# EAGLE schematic BEP33_6panel_90Grad (EAGLE 6.5.0), part 2 of 2
## Sheet 5 of 7
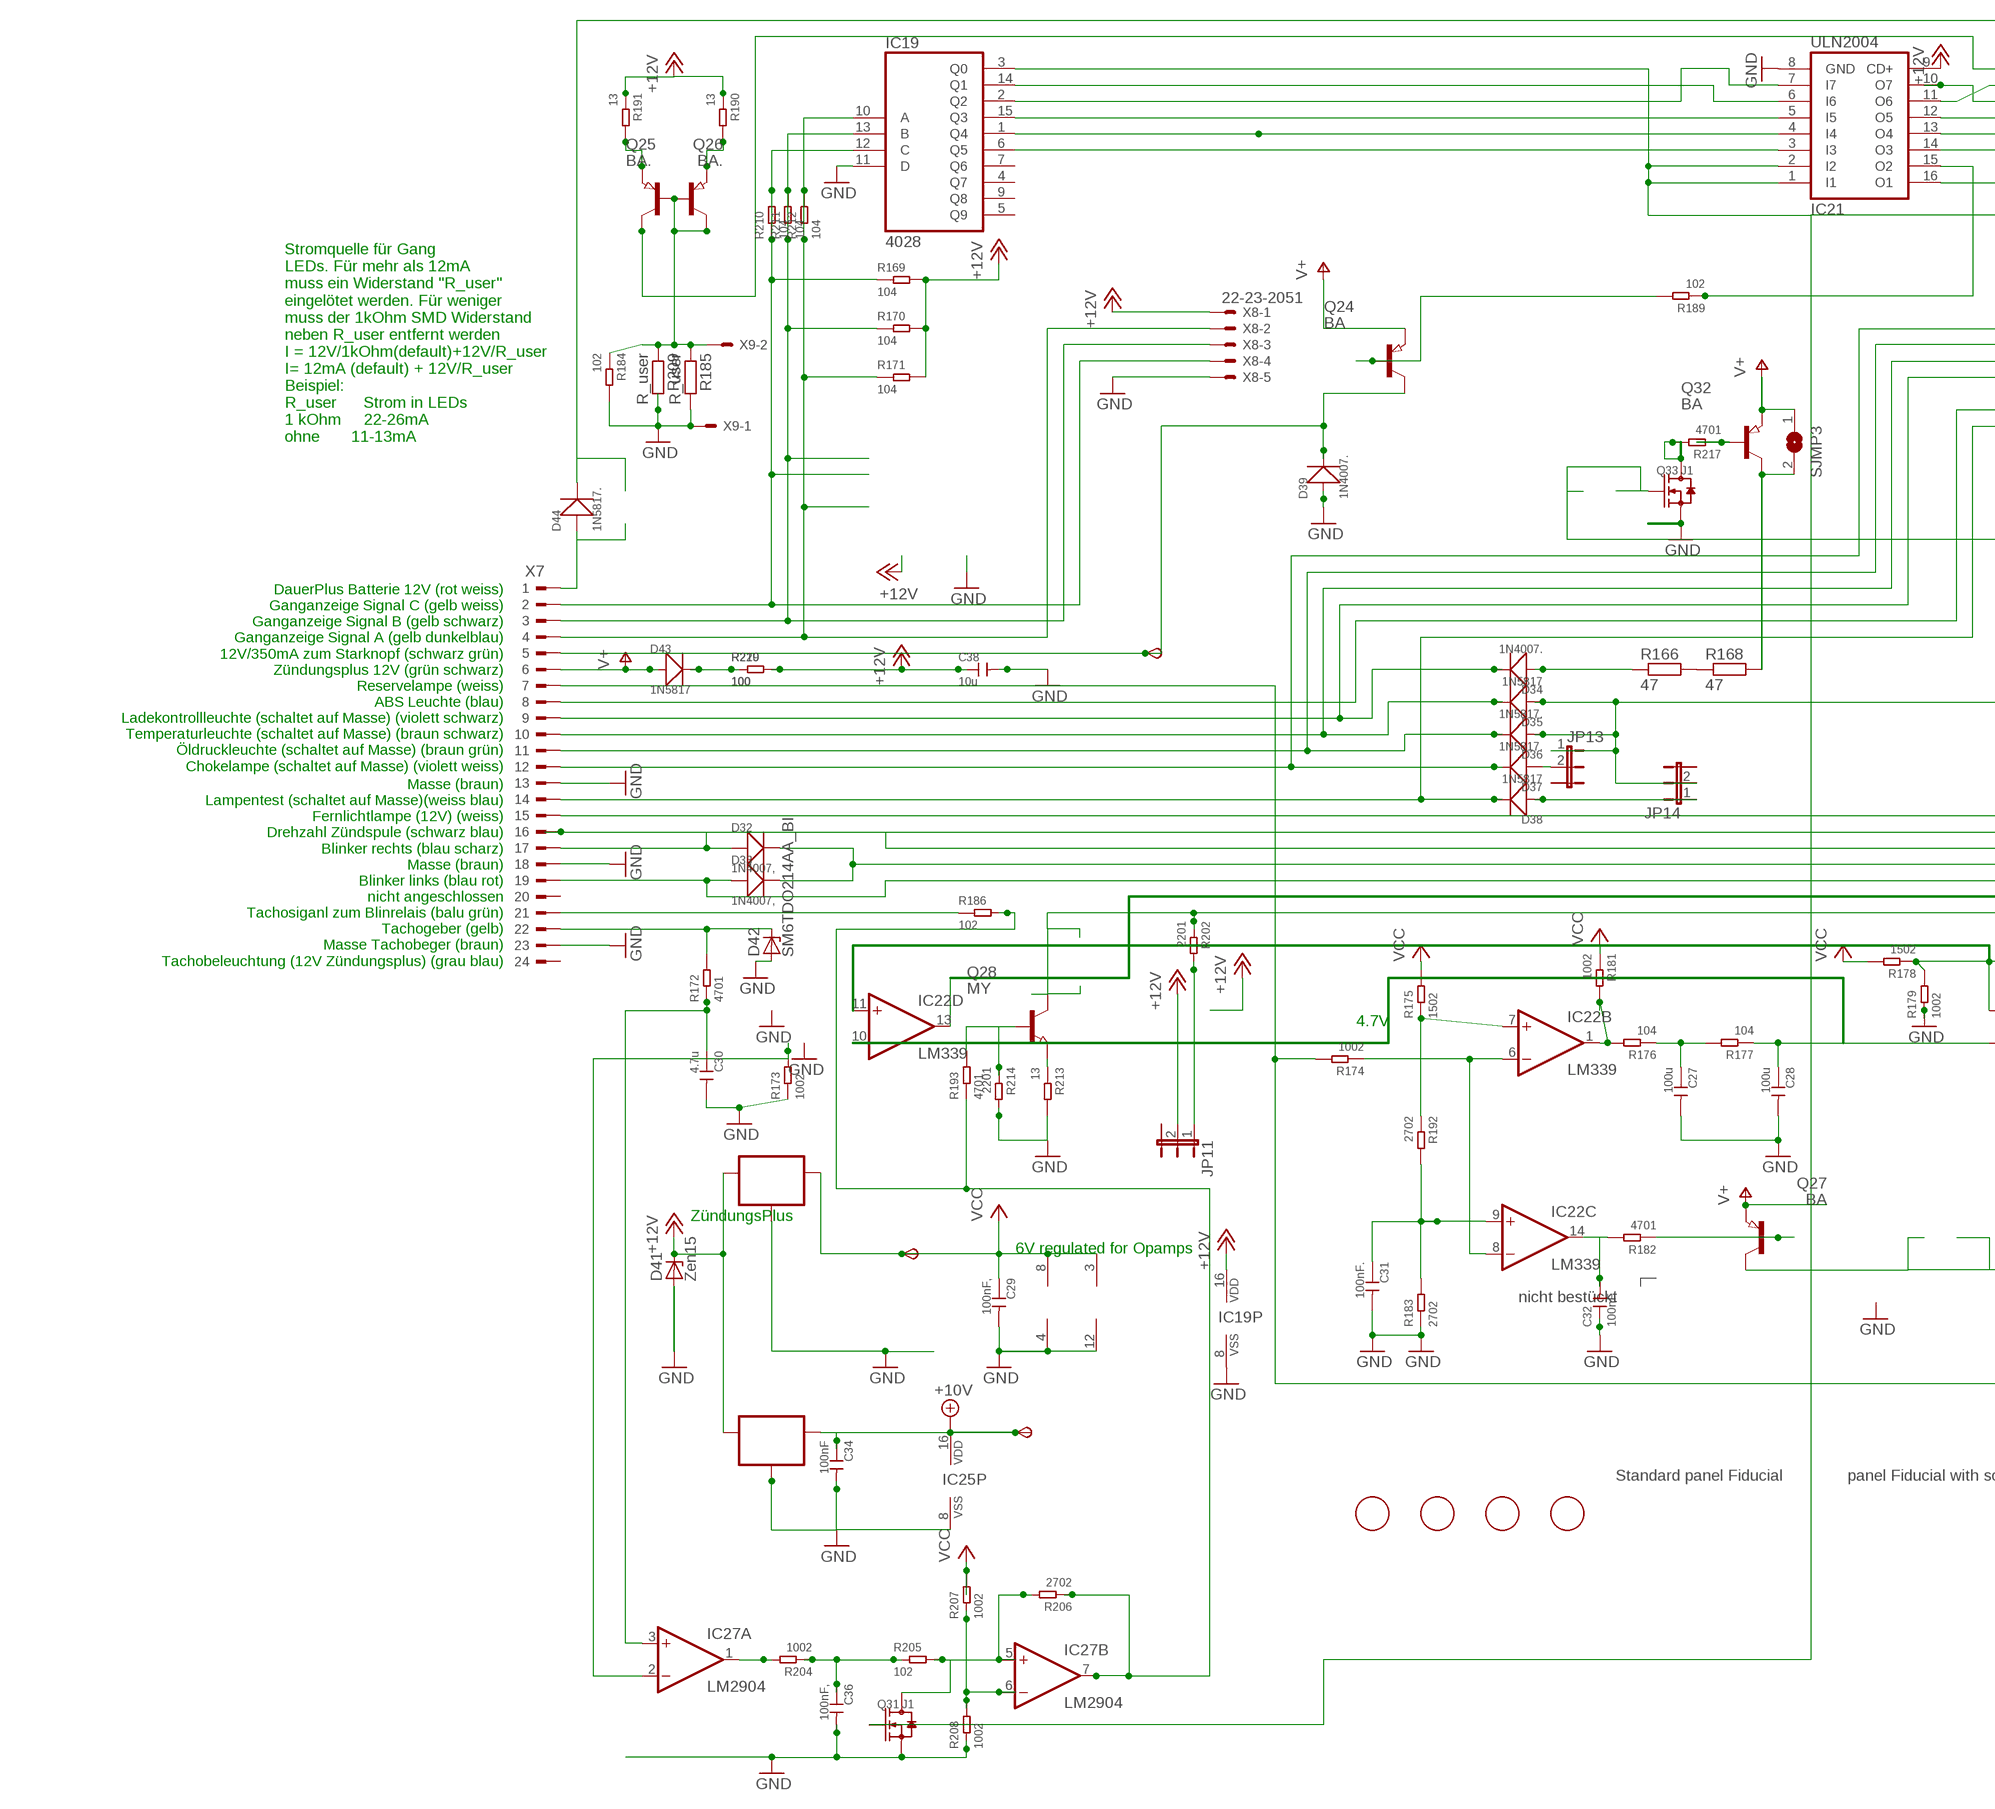
[diagram p7: schematic, sheet 5, part 1 of 2]
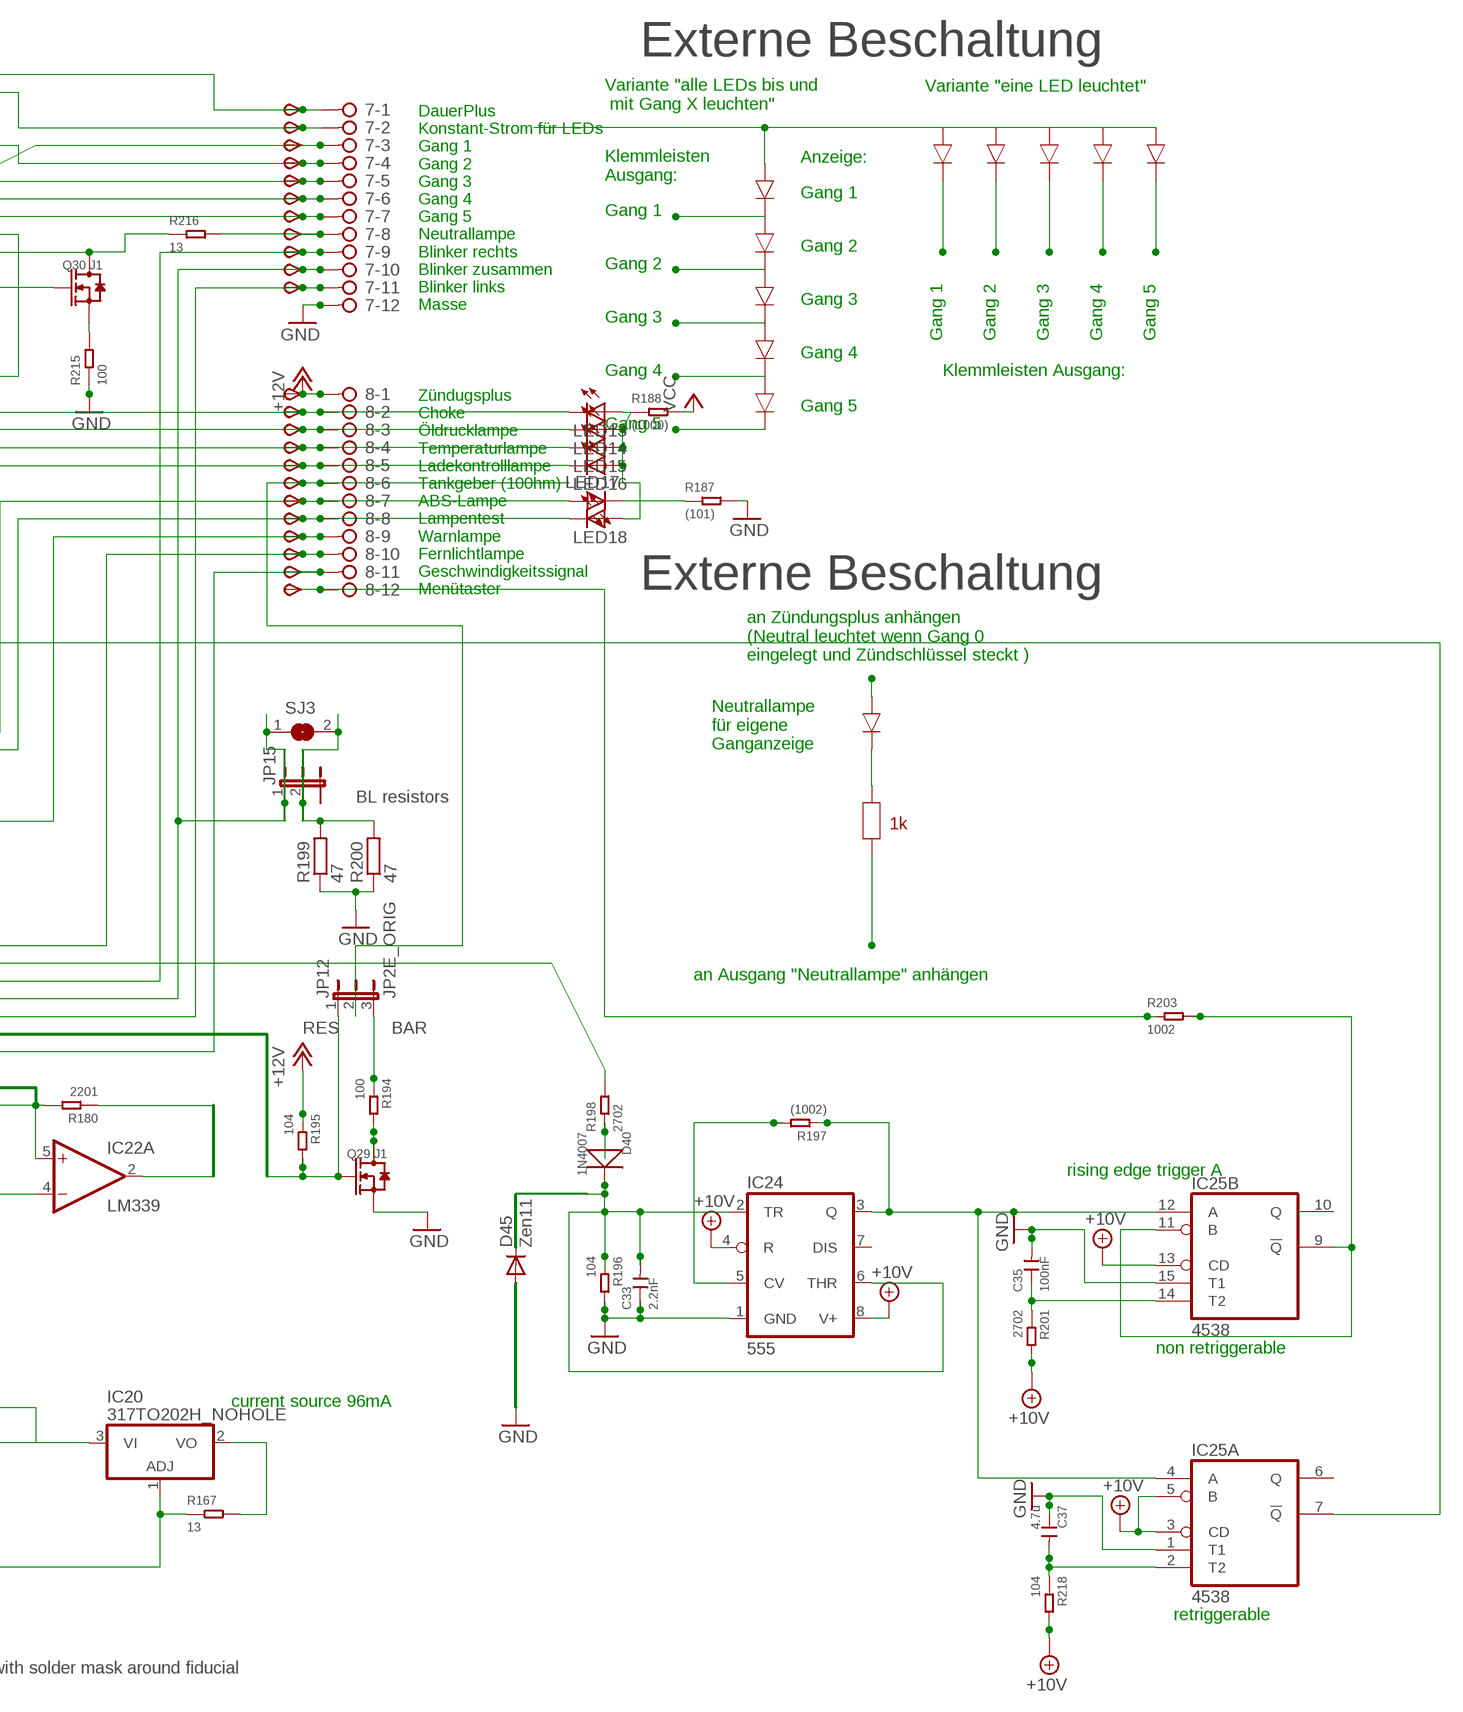
[diagram p8: schematic, sheet 5, part 2 of 2]

### Parts
6V3  TPSB2.0  [B2.0]
7  2081-1132  [12-PIN]
8  2081-1132  [12-PIN]
10V3  TPSB2.0  [B2.0]
C27  100u  CERAMIC-100UF-6.3V-20%-X5R(1206)  [C1206]
C28  100u  CERAMIC-100UF-6.3V-20%-X5R(1206)  [C1206]
C29  100nF,  CERAMIC-100NF-50V-10%-X7R(0805)  [C0805]
C30  4.7u  CERAMIC-4.7UF-25V-10%-X5R(0805)  [C0805]
C31  100nF.  CERAMIC-100NF-50V-10%-X7R(0805)  [C0805]
C32  100nF.  CERAMIC-100NF-50V-10%-X7R(0805)  [C0805]
C33  2.2nF  CERAMIC-100NF-50V-10%-X7R(0805)  [C0805]
C34  100nF  CERAMIC-100NF-50V-10%-X7R(0805)  [C0805]
C35  100nF  CERAMIC-100NF-50V-10%-X7R(0805)  [C0805]
C36  100nF,  CERAMIC-100NF-50V-10%-X7R(0805)  [C0805]
C37  4.7u  CERAMIC-4.7UF-25V-10%-X5R(0805)  [C0805]
C38  10u  CERAMIC-100UF-6.3V-20%-X5R(1206)  [C1206]
D32  1N4007,  DIODE-GEN-PURPOSE-1KV-1A(DO-214AC)  [DO-214AC]
D33  1N4007,  DIODE-GEN-PURPOSE-1KV-1A(DO-214AC)  [DO-214AC]
D34  1N4007.  DIODE-GEN-PURPOSE-1KV-1A(DO-214AC)  [DO-214AC]
D35  1N5817  DIODE-GEN-PURPOSE-1KV-1A(DO-214AC)DO-214AC/1206  [DO-214AC_SLIM]
D36  1N5817.  DIODE-GEN-PURPOSE-1KV-1A(DO-214AC)DO-214AC/1206  [DO-214AC_SLIM]
D37  1N5817.  DIODE-GEN-PURPOSE-1KV-1A(DO-214AC)DO-214AC/1206  [DO-214AC_SLIM]
D38  1N5817  DIODE-GEN-PURPOSE-1KV-1A(DO-214AC)DO-214AC/1206  [DO-214AC_SLIM]
D39  1N4007.  DIODE-GEN-PURPOSE-1KV-1A(DO-214AC)  [DO-214AC]
D40  1N4007  DIODE-GEN-PURPOSE-1KV-1A(DO-214AC)  [DO-214AC]
D41  Zen15  SM6T  [DO214AA]
D42  SM6TDO214AA_BI  [DO214AA_BI]
D43  1N5817  DIODE-GEN-PURPOSE-1KV-1A(DO-214AC)DO-214AC/1206  [DO-214AC_SLIM]
D44  1N5817.  DIODE-GEN-PURPOSE-1KV-1A(DO-214AC)DO-214AC/1206  [DO-214AC_SLIM]
D45  Zen11  CGRM4001-G  [SOD-123_MINI-SMA]
FID11  FIDUCIAL  [FIDUCIAL_1MM]
FID12  FIDUCIAL  [FIDUCIAL_1MM]
FID13  FIDUCIAL  [FIDUCIAL_1MM]
FID14  FIDUCIAL  [FIDUCIAL_1MM]
IC19  4028  4028D  [SO16]
IC20  317TO202H_NOHOLE  [TO220H_NOHOLE]
IC21  ULN2004  ULN2004AD  [SO16]
IC22  LM339  LM339D  [SO14]
IC23  78L06  78LXXSOT89_ROUND  [SOT89_ROUND]
IC24  555  NE555D  [SO08]
IC25  4538  4538D  [SO16]
IC26  78L10  78LXXSOT89_ROUND  [SOT89_ROUND]
IC27  LM2904  LM358D  [SO08]
JP11  JP2EJP2_SMALLPADS  [JP2_SMALLPADS]
JP12  JP2E_ORIG  [JP2_ORIG_SMALLPADS]
JP13  JP2EJP2_SMALLPADS  [JP2_SMALLPADS]
JP14  JP2EJP2_SMALLPADS  [JP2_SMALLPADS]
JP15  JP2EJP2_SMALLPADS  [JP2_SMALLPADS]
LED13  LEDLD260  [LD260]
LED14  LEDLD260  [LD260]
LED15  LEDLD260  [LD260]
LED16  LEDLD260  [LD260]
LED17  LEDLD260  [LD260]
LED18  LEDLD260  [LD260]
Q24  BA  PNP-TRANSISTOR_SOT89  [SOT89]
Q25  BA.  PNP-TRANSISTOR_SOT89  [SOT89]
Q26  BA.  PNP-TRANSISTOR_SOT89  [SOT89]
Q27  BA  PNP-TRANSISTOR_SOT89  [SOT89]
Q28  MY  NPN-TRANSISTOR_SOT89  [SOT89]
Q29  J1  SMD-MOSFET-N-CH-50V-200MA-BSS138W-7-F(SOT-23)  [SOT-23]
Q30  J1  SMD-MOSFET-N-CH-50V-200MA-BSS138W-7-F(SOT-23)  [SOT-23]
Q31  J1  SMD-MOSFET-N-CH-50V-200MA-BSS138W-7-F(SOT-23)  [SOT-23]
Q32  BA  PNP-TRANSISTOR_SOT89  [SOT89]
Q33  J1  SMD-MOSFET-N-CH-50V-200MA-BSS138W-7-F(SOT-23)  [SOT-23]
R166  47  R-EU_V235/17_1MM  [V235/17_1MM]
R167  13  SMD-RES-13R-5%-1/4W(1206)  [R1206]
R168  47  R-EU_V235/17_1MM  [V235/17_1MM]
R169  104  SMD-RES-10K-1%-1/8W(0805)  [R0805]
R170  104  SMD-RES-10K-1%-1/8W(0805)  [R0805]
R171  104  SMD-RES-10K-1%-1/8W(0805)  [R0805]
R172  4701  SMD-RES-4.7K-5%-1/8W(0805)  [R0805]
R173  1002  SMD-RES-10K-1%-1/8W(0805)  [R0805]
R174  1002  SMD-RES-10K-1%-1/8W(0805)  [R0805]
R175  1502  SMD-RES-10K-1%-1/8W(0805)  [R0805]
R176  104  SMD-RES-10K-1%-1/8W(0805)  [R0805]
R177  104  SMD-RES-10K-1%-1/8W(0805)  [R0805]
R178  1502  SMD-RES-10K-1%-1/8W(0805)  [R0805]
R179  1002  SMD-RES-10K-1%-1/8W(0805)  [R0805]
R180  2201  SMD-RES-2.2K-5%-1/8W(0805)  [R0805]
R181  1002  SMD-RES-10K-1%-1/8W(0805)  [R0805]
R182  4701  SMD-RES-4.7K-5%-1/8W(0805)  [R0805]
R183  2702  SMD-RES-4.7K-5%-1/8W(0805)  [R0805]
R184  102  SMD-RES-1K-5%-1/8W(0805)  [R0805]
R185  R_user  R-EU_R0805  [R0805]
R186  102  SMD-RES-220R-5%-1/8W(0805)  [R0805]
R187  (101)  SMD-RES-100R-5%-1/8W(0805)  [R0805]
R188  (1000)  SMD-RES-100R-5%-1/8W(0805)  [R0805]
R189  102  SMD-RES-1K-5%-1/8W(0805)  [R0805]
R190  13  SMD-RES-13R-5%-1/4W(1206)  [R1206]
R191  13  SMD-RES-13R-5%-1/4W(1206)  [R1206]
R192  2702  SMD-RES-4.7K-5%-1/8W(0805)  [R0805]
R193  4701  SMD-RES-4.7K-5%-1/8W(0805)  [R0805]
R194  100  SMD-RES-2.2K-5%-1/8W(0805)  [R0805]
R195  104  SMD-RES-10K-1%-1/8W(0805)  [R0805]
R196  104  SMD-RES-10K-1%-1/8W(0805)  [R0805]
R197  (1002)  SMD-RES-10K-1%-1/8W(0805)  [R0805]
R198  2702  SMD-RES-10K-1%-1/8W(0805)  [R0805]
R199  47  R-EU_V235/17_1MM  [V235/17_1MM]
R200  47  R-EU_V235/17_1MM  [V235/17_1MM]
R201  2702  SMD-RES-4.7K-5%-1/8W(0805)  [R0805]
R202  2201  SMD-RES-2.2K-5%-1/8W(0805)  [R0805]
R203  1002  SMD-RES-4.7K-5%-1/8W(0805)  [R0805]
R204  1002  SMD-RES-10K-1%-1/8W(0805)  [R0805]
R205  102  SMD-RES-1K-5%-1/8W(0805)  [R0805]
R206  2702  SMD-RES-4.7K-5%-1/8W(0805)  [R0805]
R207  1002  SMD-RES-1K-5%-1/8W(0805)  [R0805]
R208  1002  SMD-RES-1K-5%-1/8W(0805)  [R0805]
R209  R_user  R-EU_R0805  [R0805]
R210  104  SMD-RES-10K-1%-1/8W(0805)  [R0805]
R211  104  SMD-RES-10K-1%-1/8W(0805)  [R0805]
R212  104  SMD-RES-10K-1%-1/8W(0805)  [R0805]
R213  13  SMD-RES-13R-5%-1/4W(1206)  [R1206]
R214  2201  SMD-RES-1K-5%-1/8W(0805)  [R0805]
R215  100  SMD-RES-220R-5%-1/8W(0805)  [R0805]
R216  13  SMD-RES-13R-5%-1/4W(1206)  [R1206]
R217  4701  SMD-RES-4.7K-5%-1/8W(0805)  [R0805]
R218  104  SMD-RES-4.7K-5%-1/8W(0805)  [R0805]
R219  100  SMD-RES-2.2K-5%-1/8W(0805)  [R0805]
R220  100  SMD-RES-2.2K-5%-1/8W(0805)  [R0805]
SJ3  SJ  [SJ]
SJMP3  SJ  [SJ]
START3  TPSB2.0  [B2.0]
TP70  TPSB2.0  [B2.0]
TP71  TPSB2.0  [B2.0]
TP72  TPSB2.0  [B2.0]
TP73  TPSB2.0  [B2.0]
TP74  TPSB2.0  [B2.0]
TP75  TPSB2.0  [B2.0]
TP76  TPSB2.0  [B2.0]
TP77  TPSB2.0  [B2.0]
TP78  TPSB2.0  [B2.0]
TP79  TPSB2.0  [B2.0]
TP80  TPSB2.0  [B2.0]
TP81  TPSB2.0  [B2.0]
TP82  TPSB2.0  [B2.0]
TP83  TPSB2.0  [B2.0]
TP84  TPSB2.0  [B2.0]
TP85  TPSB2.0  [B2.0]
TP86  TPSB2.0  [B2.0]
TP87  TPSB2.0  [B2.0]
TP88  TPSB1,27  [B1,27]
TP89  TPSB2.0  [B2.0]
TP90  TPSB2.0  [B2.0]
TP91  TPSB2.0  [B2.0]
TP92  TPSB2.0  [B2.0]
X7  CON_BMWV2  [24-PIN_V2]
X8  22-23-2051  [22-23-2051]
X9  22-23-2021  [22-23-2021]

### Nets
+10V: 10V3.TP(PP) C34.1 IC24.4(R) IC24.8(V+) IC25.3(A:CD) IC25.5(A:B) IC25.13(B:CD) IC25.16(P:VDD) IC26.1(OUT) R201.2 R218.2 ; also sheet 2,3,4,6,7
+12V: 8.1 C38.1 D41.C IC19.16(VDD) IC21.9(CD+) IC23.3(IN) IC26.3(IN) JP11.2 R169.2 R170.2 R171.2 R190.1 R191.1 R195.1 R219.2 R220.2 TP91.TP(PP) X8.1 ; also sheet 2,3,4,6,7
+12V4: 8.11 Q28.2(C) R202.1 TP90.TP(PP)
GND: 7.12 C27.2 C28.2 C29.2 C30.2 C31.2 C32.1 C33.1 C34.2 C35.2 C36.2 C37.1 C38.2 D39.1(+) D41.A D42.A D45.A IC19.8(VSS) IC19.11(D) IC21.8(GND) IC22.12(P:GND) IC23.2(GND) IC23.2@1(GND) IC24.1(GND) IC25.1(A:T1) IC25.8(P:VSS) IC25.15(B:T1) IC26.2(GND) IC26.2@1(GND) IC27.4(P:V-) Q29.2(S) Q31.2(S) Q33.2(S) R173.1 R179.1 R183.1 R184.2 R185.2 R187.2 R196.2 R199.1 R200.1 R208.1 R209.2 R213.2 R214.2 R215.1 X7.13 X7.18 X7.23 X8.5 X9.1 ; also sheet 2,3,4,6,7
N$701: R166.2 R168.1
N$702: 8.9 D35.1(+) D36.1(+) JP13.1 JP14.2 TP88.TP(PP)
N$703: IC19.10(A) R171.1 R212.1 R212.2 X7.4 X8.2
N$704: IC19.13(B) R170.1 R211.1 R211.2 X7.3 X8.3
N$705: D39.2(-) Q24.2(C) START3.TP(PP) X7.5
N$706: IC19.12(C) R169.1 R210.1 R210.2 X7.2 X8.4
N$707: 8.7 LED17.A TP86.TP(PP) X7.8
N$708: 8.2 D37.2(-) LED13.K(C) TP81.TP(PP) X7.12
N$709: 8.3 D36.2(-) LED14.K(C) TP82.TP(PP) X7.11
N$710: 8.4 D35.2(-) LED15.K(C) TP83.TP(PP) X7.10
N$711: 8.8 D38.2(-) LED18.K(C) TP87.TP(PP) X7.14
N$712: 7.9 D32.1(+) TP78.TP(PP) X7.17
N$713: 7.11 D33.1(+) TP80.TP(PP) X7.19
N$714: D42.C R172.2 X7.22
N$715: C30.1 IC27.3(A:+IN) R172.1
N$716: IC22.1(B:OUT) R176.2 R181.2
N$717: C27.1 R176.1 R177.2
N$718: C28.1 IC22.4(A:-IN) IC22.10(D:-IN) R177.1
N$719: IC22.5(A:+IN) IC22.11(D:+IN) R178.1 R179.2 R180.2
N$720: C31.1 IC22.9(C:+IN) R183.2 R192.2
N$721: C32.2 IC22.14(C:OUT) R182.2
N$722: Q27.1(B) R182.1
N$723: IC19.2(Q2) IC21.7(I7)
N$724: 7.5 IC21.12(O5) TP74.TP(PP)
N$725: IC19.1(Q4) IC21.4(I4)
N$726: 8.10 TP89.TP(PP) X7.15
N$727: 8.5 D34.2(-) LED16.K(C) TP84.TP(PP) X7.9
N$728: D34.1(+) R166.1
N$729: IC19.6(Q5) IC21.3(I3)
N$730: 7.4 IC21.10(O7) TP73.TP(PP)
N$731: IC20.1(ADJ) R167.1 R174.2 X7.7
N$732: IC22.6(B:-IN) IC22.8(C:-IN) R174.1
N$733: 7.2 Q26.2(C) TP71.TP(PP)
N$734: 7.1 D44.2(-) TP70.TP(PP)
N$748: R198.2 X7.16
N$749: IC19.15(Q3) IC21.5(I5)
N$750: 7.6 IC21.13(O4) TP75.TP(PP)
N$751: 7.7 IC21.14(O3) TP76.TP(PP)
N$752: 8.6 JP12.2 TP85.TP(PP)
N$753: LED17.K(C) R187.1
N$754: LED13.A LED14.A LED15.A LED16.A LED18.A R188.1
N$755: Q24.1(B) R189.2
N$756: IC19.3(Q0) IC21.1(I1) IC21.2(I2) Q30.1(G) Q31.1(G)
N$757: IC19.14(Q1) IC21.6(I6)
N$758: 7.3 IC21.11(O6) TP72.TP(PP)
N$759: Q25.1(B) Q25.2(C) Q26.1(B) R184.1 R185.1 R209.1 X9.2
N$760: Q26.3(E) R191.2
N$761: Q25.3(E) R190.2
N$762: IC22.7(B:+IN) R175.1 R192.1
N$763: IC27.2(A:-IN) R173.2
N$764: Q28.1(B) R193.2 R214.1
N$765: Q29.3(D) R194.2
N$766: IC20.2(VO) R167.2
N$767: IC20.3(VI) Q27.2(C)
N$768: IC24.5(CV) R197.2
N$769: IC24.3(Q) IC25.4(A:A) IC25.12(B:A) R197.1
N$770: D40.1(+) R198.1
N$771: 7.10 D32.2(-) D33.2(-) JP15.1 SJ3.1 TP79.TP(PP)
N$772: JP15.2 R199.2 R200.2 SJ3.2
N$773: IC25.9(B:!Q) IC25.11(B:B) R203.2
N$774: C35.1 IC25.14(B:T2) R201.1
N$775: JP11.1 R202.2
N$776: IC21.15(O2) R189.1
N$777: 8.12 R203.1 TP92.TP(PP)
N$778: D37.1(+) JP13.2
N$779: IC27.1(A:OUT) R204.2
N$780: C36.1 R204.1 R205.1
N$781: IC27.5(B:+IN) Q31.3(D) R205.2 R206.2
N$782: IC27.6(B:-IN) R207.1 R208.2
N$783: D38.1(+) JP14.1
N$784: JP12.3 R194.1
N$785: IC22.13(D:OUT) JP12.1 Q29.1(G) R195.2
N$786: R186.1 X7.21
N$787: IC21.16(O1) Q30.3(D) R216.1
N$788: D43.2(-) R219.1 R220.1
N$789: 7.8 R216.2 TP77.TP(PP)
N$790: Q30.2(S) R215.2
N$791: D44.1(+) X7.1
N$792: Q28.3(E) R213.1
N$793: C33.2 D40.2(-) D45.C IC24.2(TR) IC24.6(THR) R196.1
N$794: Q32.1(B) R217.1
N$795: Q33.3(D) R217.2
N$796: Q32.2(C) R168.2 SJMP3.2
N$797: IC27.7(B:OUT) R186.2 R193.1 R206.1
N$798: IC22.2(A:OUT) R180.1
N$799: IC25.7(A:!Q) Q33.1(G)
N$800: C37.2 IC25.2(A:T2) R218.1
V+: D43.1(+) Q24.3(E) Q27.3(E) Q32.3(E) SJMP3.1 X7.6 ; also sheet 2,3,4,6,7
VCC: 6V3.TP(PP) C29.1 IC22.3(P:V+) IC23.1(OUT) IC27.8(P:V+) R175.2 R178.2 R181.1 R188.2 R207.2 ; also sheet 2,3,4,6,7
Unconnected: IC19.4(Q7) IC19.5(Q9) IC19.7(Q6) IC19.9(Q8) IC24.7(DIS) IC25.6(A:Q) IC25.10(B:Q) X7.20 X7.24

### Notes on the sheet
- Externe Beschaltung
- Variante "eine LED leuchtet"
- Variante "alle LEDs bis und
   mit Gang X leuchten"
- Anzeige:
- Klemmleisten
  Ausgang:
- Gang 1
- DauerPlus
  Konstant-Strom für LEDs
  Gang 1
  Gang 2
  Gang 3
  Gang 4
  Gang 5
  Neutrallampe
  Blinker rechts
  Blinker zusammen
  Blinker links
  Masse
- Gang 1
- Gang 2
- Gang 2
- Gang 3
- Gang 3
- Gang 1 | Gang 2 | Gang 3 | Gang 4 | Gang 5
- Gang 4
- Gang 4 | Klemmleisten Ausgang:
- Gang 5
- Gang 5
- Zündugsplus
  Choke
  Öldrucklampe
  Temperaturlampe
  Ladekontrolllampe
  Tankgeber (100hm)
  ABS-Lampe
  Lampentest
  Warnlampe
  Fernlichtlampe
  Geschwindigkeitssignal
  Menütaster
- Stromquelle für Gang
  LEDs. Für mehr als 12mA
  muss ein Widerstand "R_user"
  eingelötet werden. Für weniger
  muss der 1kOhm SMD Widerstand
  neben R_user entfernt werden
  I = 12V/1kOhm(default)+12V/R_user
  I= 12mA (default) + 12V/R_user
  Beispiel:
  R_user      Strom in LEDs
  1 kOhm     22-26mA
  ohne       11-13mA
- Externe Beschaltung
- an Zündungsplus anhängen
  (Neutral leuchtet wenn Gang 0
  eingelegt und Zündschlüssel steckt )
- Neutrallampe
  für eigene
  Ganganzeige
- DauerPlus Batterie 12V (rot weiss)
  Ganganzeige Signal C (gelb weiss)
  Ganganzeige Signal B (gelb schwarz)
  Ganganzeige Signal A (gelb dunkelblau)
  12V/350mA zum Starknopf (schwarz grün)
  Zündungsplus 12V (grün schwarz)
  Reservelampe (weiss)
  ABS Leuchte (blau)
  Ladekontrollleuchte (schaltet auf Masse) (violett schwarz)
  Temperaturleuchte (schaltet auf Masse) (braun schwarz)
  Öldruckleuchte (schaltet auf Masse) (braun grün)
  Chokelampe (schaltet auf Masse) (violett weiss)
- BL resistors
- 1k
- an Ausgang "Neutrallampe" anhängen
- Masse (braun)
  Lampentest (schaltet auf Masse)(weiss blau)
  Fernlichtlampe (12V) (weiss)
  Drehzahl Zündspule (schwarz blau)
  Blinker rechts (blau scharz)
  Masse (braun)
  Blinker links (blau rot)
  nicht angeschlossen
  Tachosiganl zum Blinrelais (balu grün)
  Tachogeber (gelb)
  Masse Tachobeger (braun)
  Tachobeleuchtung (12V Zündungsplus) (grau blau)
- RES | BAR
- 4.7V | rising edge trigger A
- non retriggerable
- ZündungsPlus
- current source 96mA
- 6V regulated for Opamps
- nicht bestückt
- retriggerable
- Standard panel Fiducial | panel Fiducial with solder mask around fiducial

## Sheet 6 of 7
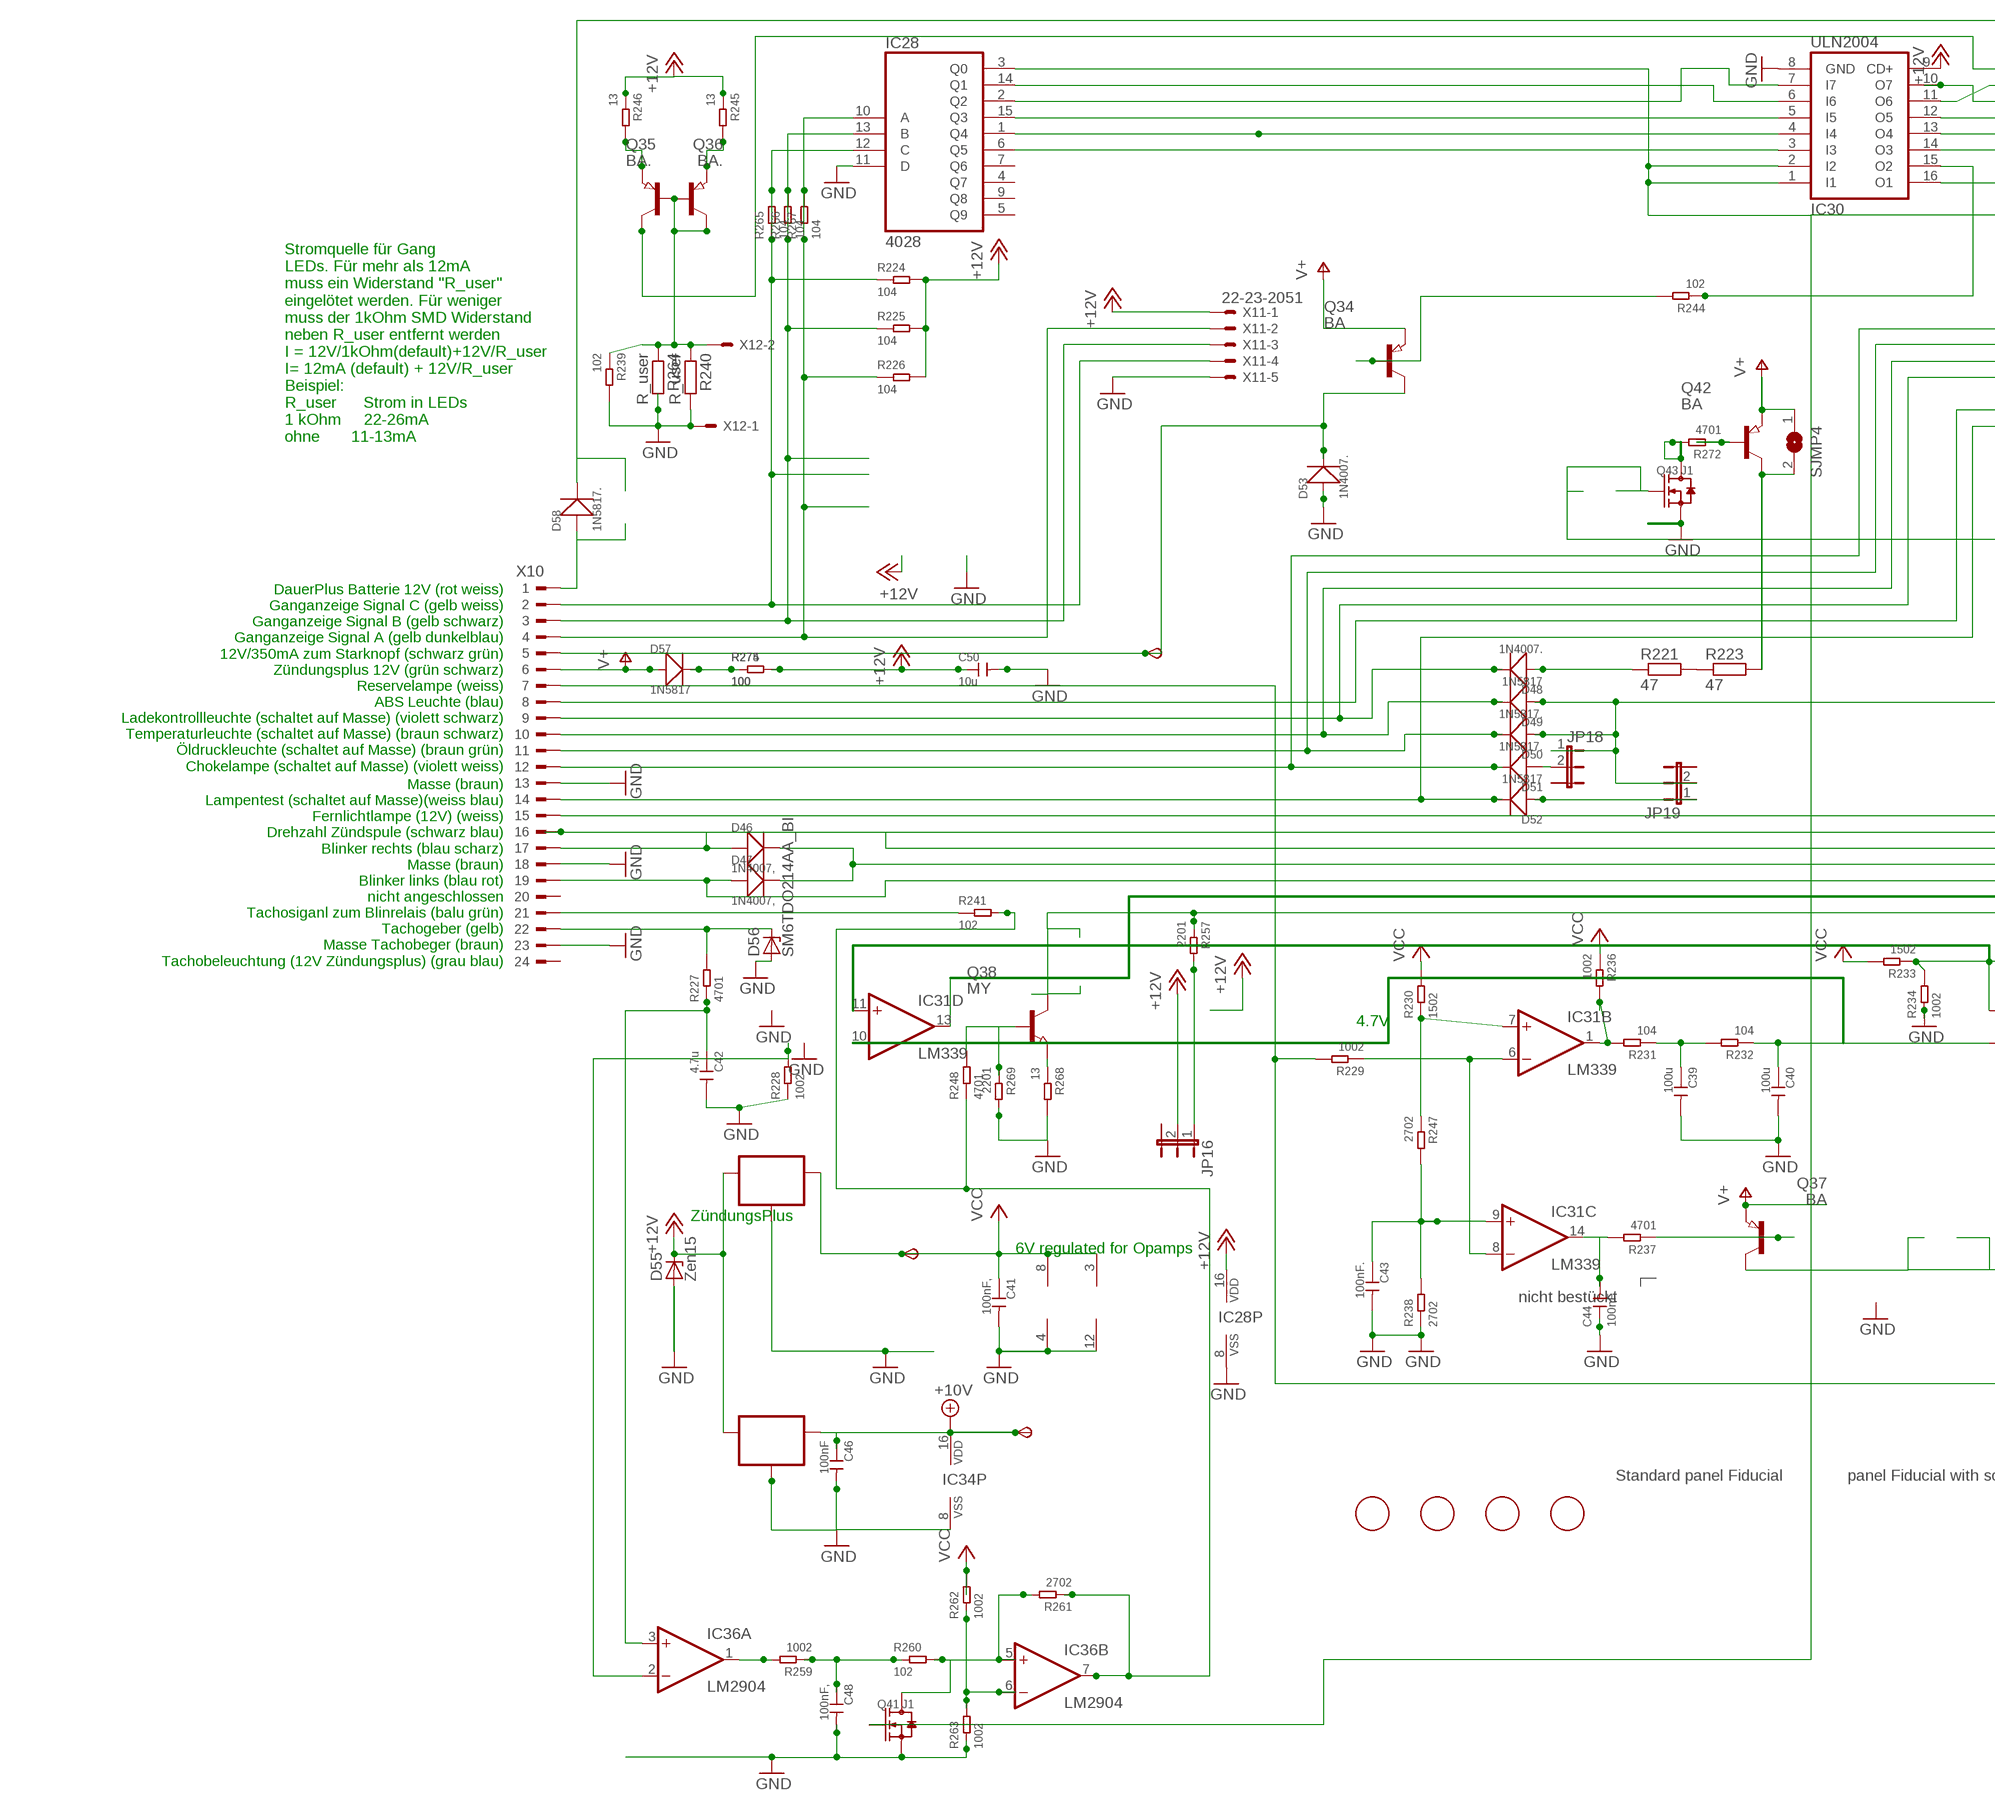
[diagram p9: schematic, sheet 6, part 1 of 2]
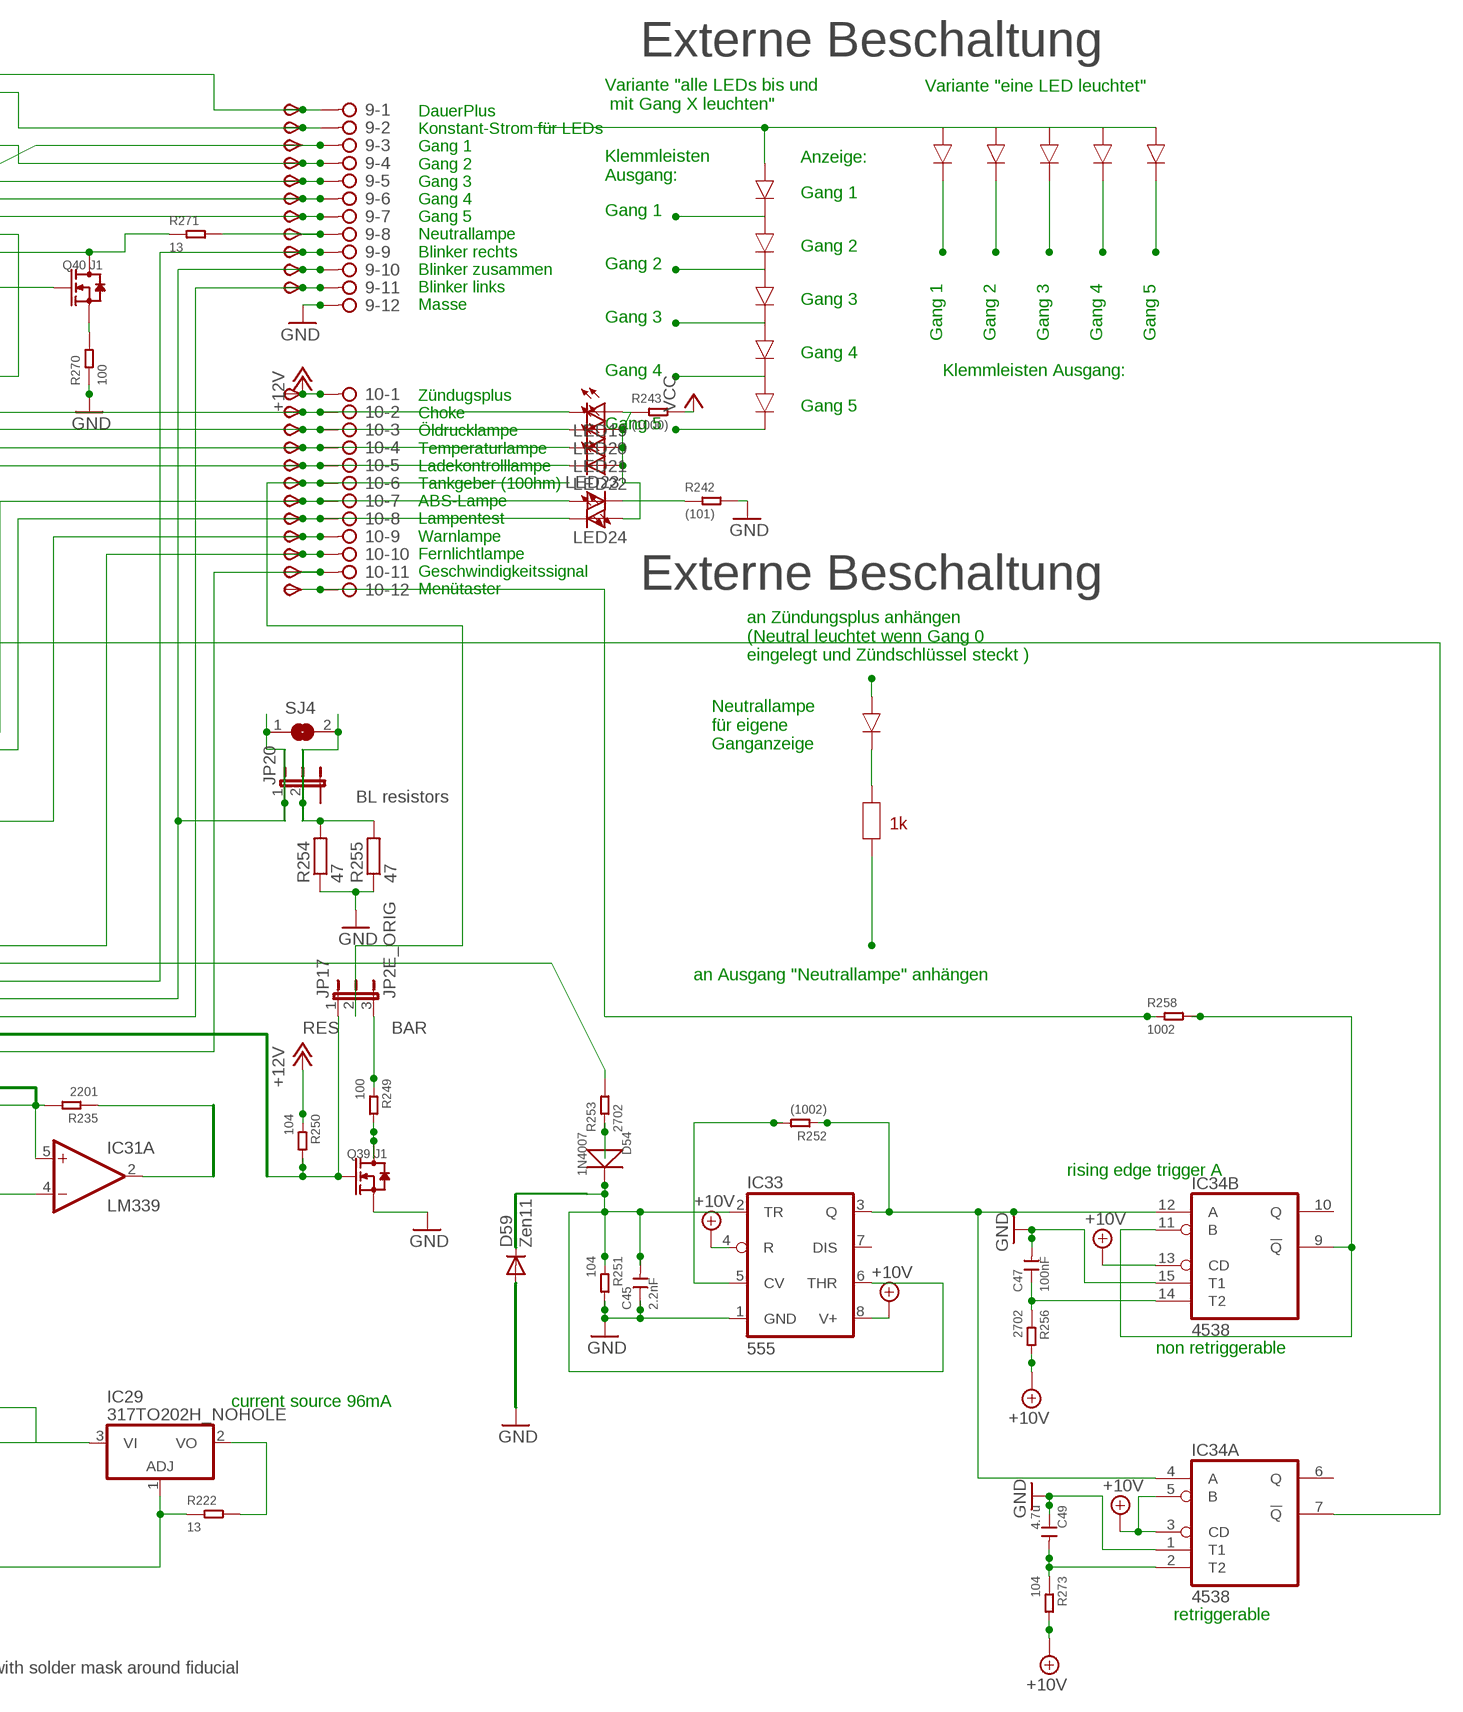
[diagram p10: schematic, sheet 6, part 2 of 2]

### Parts
6V4  TPSB2.0  [B2.0]
9  2081-1132  [12-PIN]
10  2081-1132  [12-PIN]
10V4  TPSB2.0  [B2.0]
C39  100u  CERAMIC-100UF-6.3V-20%-X5R(1206)  [C1206]
C40  100u  CERAMIC-100UF-6.3V-20%-X5R(1206)  [C1206]
C41  100nF,  CERAMIC-100NF-50V-10%-X7R(0805)  [C0805]
C42  4.7u  CERAMIC-4.7UF-25V-10%-X5R(0805)  [C0805]
C43  100nF.  CERAMIC-100NF-50V-10%-X7R(0805)  [C0805]
C44  100nF.  CERAMIC-100NF-50V-10%-X7R(0805)  [C0805]
C45  2.2nF  CERAMIC-100NF-50V-10%-X7R(0805)  [C0805]
C46  100nF  CERAMIC-100NF-50V-10%-X7R(0805)  [C0805]
C47  100nF  CERAMIC-100NF-50V-10%-X7R(0805)  [C0805]
C48  100nF,  CERAMIC-100NF-50V-10%-X7R(0805)  [C0805]
C49  4.7u  CERAMIC-4.7UF-25V-10%-X5R(0805)  [C0805]
C50  10u  CERAMIC-100UF-6.3V-20%-X5R(1206)  [C1206]
D46  1N4007,  DIODE-GEN-PURPOSE-1KV-1A(DO-214AC)  [DO-214AC]
D47  1N4007,  DIODE-GEN-PURPOSE-1KV-1A(DO-214AC)  [DO-214AC]
D48  1N4007.  DIODE-GEN-PURPOSE-1KV-1A(DO-214AC)  [DO-214AC]
D49  1N5817  DIODE-GEN-PURPOSE-1KV-1A(DO-214AC)DO-214AC/1206  [DO-214AC_SLIM]
D50  1N5817.  DIODE-GEN-PURPOSE-1KV-1A(DO-214AC)DO-214AC/1206  [DO-214AC_SLIM]
D51  1N5817.  DIODE-GEN-PURPOSE-1KV-1A(DO-214AC)DO-214AC/1206  [DO-214AC_SLIM]
D52  1N5817  DIODE-GEN-PURPOSE-1KV-1A(DO-214AC)DO-214AC/1206  [DO-214AC_SLIM]
D53  1N4007.  DIODE-GEN-PURPOSE-1KV-1A(DO-214AC)  [DO-214AC]
D54  1N4007  DIODE-GEN-PURPOSE-1KV-1A(DO-214AC)  [DO-214AC]
D55  Zen15  SM6T  [DO214AA]
D56  SM6TDO214AA_BI  [DO214AA_BI]
D57  1N5817  DIODE-GEN-PURPOSE-1KV-1A(DO-214AC)DO-214AC/1206  [DO-214AC_SLIM]
D58  1N5817.  DIODE-GEN-PURPOSE-1KV-1A(DO-214AC)DO-214AC/1206  [DO-214AC_SLIM]
D59  Zen11  CGRM4001-G  [SOD-123_MINI-SMA]
FID15  FIDUCIAL  [FIDUCIAL_1MM]
FID16  FIDUCIAL  [FIDUCIAL_1MM]
FID17  FIDUCIAL  [FIDUCIAL_1MM]
FID18  FIDUCIAL  [FIDUCIAL_1MM]
IC28  4028  4028D  [SO16]
IC29  317TO202H_NOHOLE  [TO220H_NOHOLE]
IC30  ULN2004  ULN2004AD  [SO16]
IC31  LM339  LM339D  [SO14]
IC32  78L06  78LXXSOT89_ROUND  [SOT89_ROUND]
IC33  555  NE555D  [SO08]
IC34  4538  4538D  [SO16]
IC35  78L10  78LXXSOT89_ROUND  [SOT89_ROUND]
IC36  LM2904  LM358D  [SO08]
JP16  JP2EJP2_SMALLPADS  [JP2_SMALLPADS]
JP17  JP2E_ORIG  [JP2_ORIG_SMALLPADS]
JP18  JP2EJP2_SMALLPADS  [JP2_SMALLPADS]
JP19  JP2EJP2_SMALLPADS  [JP2_SMALLPADS]
JP20  JP2EJP2_SMALLPADS  [JP2_SMALLPADS]
LED19  LEDLD260  [LD260]
LED20  LEDLD260  [LD260]
LED21  LEDLD260  [LD260]
LED22  LEDLD260  [LD260]
LED23  LEDLD260  [LD260]
LED24  LEDLD260  [LD260]
Q34  BA  PNP-TRANSISTOR_SOT89  [SOT89]
Q35  BA.  PNP-TRANSISTOR_SOT89  [SOT89]
Q36  BA.  PNP-TRANSISTOR_SOT89  [SOT89]
Q37  BA  PNP-TRANSISTOR_SOT89  [SOT89]
Q38  MY  NPN-TRANSISTOR_SOT89  [SOT89]
Q39  J1  SMD-MOSFET-N-CH-50V-200MA-BSS138W-7-F(SOT-23)  [SOT-23]
Q40  J1  SMD-MOSFET-N-CH-50V-200MA-BSS138W-7-F(SOT-23)  [SOT-23]
Q41  J1  SMD-MOSFET-N-CH-50V-200MA-BSS138W-7-F(SOT-23)  [SOT-23]
Q42  BA  PNP-TRANSISTOR_SOT89  [SOT89]
Q43  J1  SMD-MOSFET-N-CH-50V-200MA-BSS138W-7-F(SOT-23)  [SOT-23]
R221  47  R-EU_V235/17_1MM  [V235/17_1MM]
R222  13  SMD-RES-13R-5%-1/4W(1206)  [R1206]
R223  47  R-EU_V235/17_1MM  [V235/17_1MM]
R224  104  SMD-RES-10K-1%-1/8W(0805)  [R0805]
R225  104  SMD-RES-10K-1%-1/8W(0805)  [R0805]
R226  104  SMD-RES-10K-1%-1/8W(0805)  [R0805]
R227  4701  SMD-RES-4.7K-5%-1/8W(0805)  [R0805]
R228  1002  SMD-RES-10K-1%-1/8W(0805)  [R0805]
R229  1002  SMD-RES-10K-1%-1/8W(0805)  [R0805]
R230  1502  SMD-RES-10K-1%-1/8W(0805)  [R0805]
R231  104  SMD-RES-10K-1%-1/8W(0805)  [R0805]
R232  104  SMD-RES-10K-1%-1/8W(0805)  [R0805]
R233  1502  SMD-RES-10K-1%-1/8W(0805)  [R0805]
R234  1002  SMD-RES-10K-1%-1/8W(0805)  [R0805]
R235  2201  SMD-RES-2.2K-5%-1/8W(0805)  [R0805]
R236  1002  SMD-RES-10K-1%-1/8W(0805)  [R0805]
R237  4701  SMD-RES-4.7K-5%-1/8W(0805)  [R0805]
R238  2702  SMD-RES-4.7K-5%-1/8W(0805)  [R0805]
R239  102  SMD-RES-1K-5%-1/8W(0805)  [R0805]
R240  R_user  R-EU_R0805  [R0805]
R241  102  SMD-RES-220R-5%-1/8W(0805)  [R0805]
R242  (101)  SMD-RES-100R-5%-1/8W(0805)  [R0805]
R243  (1000)  SMD-RES-100R-5%-1/8W(0805)  [R0805]
R244  102  SMD-RES-1K-5%-1/8W(0805)  [R0805]
R245  13  SMD-RES-13R-5%-1/4W(1206)  [R1206]
R246  13  SMD-RES-13R-5%-1/4W(1206)  [R1206]
R247  2702  SMD-RES-4.7K-5%-1/8W(0805)  [R0805]
R248  4701  SMD-RES-4.7K-5%-1/8W(0805)  [R0805]
R249  100  SMD-RES-2.2K-5%-1/8W(0805)  [R0805]
R250  104  SMD-RES-10K-1%-1/8W(0805)  [R0805]
R251  104  SMD-RES-10K-1%-1/8W(0805)  [R0805]
R252  (1002)  SMD-RES-10K-1%-1/8W(0805)  [R0805]
R253  2702  SMD-RES-10K-1%-1/8W(0805)  [R0805]
R254  47  R-EU_V235/17_1MM  [V235/17_1MM]
R255  47  R-EU_V235/17_1MM  [V235/17_1MM]
R256  2702  SMD-RES-4.7K-5%-1/8W(0805)  [R0805]
R257  2201  SMD-RES-2.2K-5%-1/8W(0805)  [R0805]
R258  1002  SMD-RES-4.7K-5%-1/8W(0805)  [R0805]
R259  1002  SMD-RES-10K-1%-1/8W(0805)  [R0805]
R260  102  SMD-RES-1K-5%-1/8W(0805)  [R0805]
R261  2702  SMD-RES-4.7K-5%-1/8W(0805)  [R0805]
R262  1002  SMD-RES-1K-5%-1/8W(0805)  [R0805]
R263  1002  SMD-RES-1K-5%-1/8W(0805)  [R0805]
R264  R_user  R-EU_R0805  [R0805]
R265  104  SMD-RES-10K-1%-1/8W(0805)  [R0805]
R266  104  SMD-RES-10K-1%-1/8W(0805)  [R0805]
R267  104  SMD-RES-10K-1%-1/8W(0805)  [R0805]
R268  13  SMD-RES-13R-5%-1/4W(1206)  [R1206]
R269  2201  SMD-RES-1K-5%-1/8W(0805)  [R0805]
R270  100  SMD-RES-220R-5%-1/8W(0805)  [R0805]
R271  13  SMD-RES-13R-5%-1/4W(1206)  [R1206]
R272  4701  SMD-RES-4.7K-5%-1/8W(0805)  [R0805]
R273  104  SMD-RES-4.7K-5%-1/8W(0805)  [R0805]
R274  100  SMD-RES-2.2K-5%-1/8W(0805)  [R0805]
R275  100  SMD-RES-2.2K-5%-1/8W(0805)  [R0805]
SJ4  SJ  [SJ]
SJMP4  SJ  [SJ]
START4  TPSB2.0  [B2.0]
TP93  TPSB2.0  [B2.0]
TP94  TPSB2.0  [B2.0]
TP95  TPSB2.0  [B2.0]
TP96  TPSB2.0  [B2.0]
TP97  TPSB2.0  [B2.0]
TP98  TPSB2.0  [B2.0]
TP99  TPSB2.0  [B2.0]
TP100  TPSB2.0  [B2.0]
TP101  TPSB2.0  [B2.0]
TP102  TPSB2.0  [B2.0]
TP103  TPSB2.0  [B2.0]
TP104  TPSB2.0  [B2.0]
TP105  TPSB2.0  [B2.0]
TP106  TPSB2.0  [B2.0]
TP107  TPSB2.0  [B2.0]
TP108  TPSB2.0  [B2.0]
TP109  TPSB2.0  [B2.0]
TP110  TPSB2.0  [B2.0]
TP111  TPSB1,27  [B1,27]
TP112  TPSB2.0  [B2.0]
TP113  TPSB2.0  [B2.0]
TP114  TPSB2.0  [B2.0]
TP115  TPSB2.0  [B2.0]
X10  CON_BMWV2  [24-PIN_V2]
X11  22-23-2051  [22-23-2051]
X12  22-23-2021  [22-23-2021]

### Nets
+10V: 10V4.TP(PP) C46.1 IC33.4(R) IC33.8(V+) IC34.3(A:CD) IC34.5(A:B) IC34.13(B:CD) IC34.16(P:VDD) IC35.1(OUT) R256.2 R273.2 ; also sheet 2,3,4,5,7
+12V: 10.1 C50.1 D55.C IC28.16(VDD) IC30.9(CD+) IC32.3(IN) IC35.3(IN) JP16.2 R224.2 R225.2 R226.2 R245.1 R246.1 R250.1 R274.2 R275.2 TP114.TP(PP) X11.1 ; also sheet 2,3,4,5,7
+12V5: 10.11 Q38.2(C) R257.1 TP113.TP(PP)
GND: 9.12 C39.2 C40.2 C41.2 C42.2 C43.2 C44.1 C45.1 C46.2 C47.2 C48.2 C49.1 C50.2 D53.1(+) D55.A D56.A D59.A IC28.8(VSS) IC28.11(D) IC30.8(GND) IC31.12(P:GND) IC32.2(GND) IC32.2@1(GND) IC33.1(GND) IC34.1(A:T1) IC34.8(P:VSS) IC34.15(B:T1) IC35.2(GND) IC35.2@1(GND) IC36.4(P:V-) Q39.2(S) Q41.2(S) Q43.2(S) R228.1 R234.1 R238.1 R239.2 R240.2 R242.2 R251.2 R254.1 R255.1 R263.1 R264.2 R268.2 R269.2 R270.1 X10.13 X10.18 X10.23 X11.5 X12.1 ; also sheet 2,3,4,5,7
N$939: R221.2 R223.1
N$940: 10.9 D49.1(+) D50.1(+) JP18.1 JP19.2 TP111.TP(PP)
N$941: IC28.10(A) R226.1 R267.1 R267.2 X10.4 X11.2
N$942: IC28.13(B) R225.1 R266.1 R266.2 X10.3 X11.3
N$943: D53.2(-) Q34.2(C) START4.TP(PP) X10.5
N$944: IC28.12(C) R224.1 R265.1 R265.2 X10.2 X11.4
N$945: 10.7 LED23.A TP109.TP(PP) X10.8
N$946: 10.2 D51.2(-) LED19.K(C) TP104.TP(PP) X10.12
N$947: 10.3 D50.2(-) LED20.K(C) TP105.TP(PP) X10.11
N$948: 10.4 D49.2(-) LED21.K(C) TP106.TP(PP) X10.10
N$949: 10.8 D52.2(-) LED24.K(C) TP110.TP(PP) X10.14
N$950: 9.9 D46.1(+) TP101.TP(PP) X10.17
N$951: 9.11 D47.1(+) TP103.TP(PP) X10.19
N$952: D56.C R227.2 X10.22
N$953: C42.1 IC36.3(A:+IN) R227.1
N$954: IC31.1(B:OUT) R231.2 R236.2
N$955: C39.1 R231.1 R232.2
N$956: C40.1 IC31.4(A:-IN) IC31.10(D:-IN) R232.1
N$957: IC31.5(A:+IN) IC31.11(D:+IN) R233.1 R234.2 R235.2
N$958: C43.1 IC31.9(C:+IN) R238.2 R247.2
N$959: C44.2 IC31.14(C:OUT) R237.2
N$960: Q37.1(B) R237.1
N$961: IC28.2(Q2) IC30.7(I7)
N$962: 9.5 IC30.12(O5) TP97.TP(PP)
N$963: IC28.1(Q4) IC30.4(I4)
N$964: 10.10 TP112.TP(PP) X10.15
N$965: 10.5 D48.2(-) LED22.K(C) TP107.TP(PP) X10.9
N$966: D48.1(+) R221.1
N$967: IC28.6(Q5) IC30.3(I3)
N$968: 9.4 IC30.10(O7) TP96.TP(PP)
N$969: IC29.1(ADJ) R222.1 R229.2 X10.7
N$970: IC31.6(B:-IN) IC31.8(C:-IN) R229.1
N$971: 9.2 Q36.2(C) TP94.TP(PP)
N$972: 9.1 D58.2(-) TP93.TP(PP)
N$986: R253.2 X10.16
N$987: IC28.15(Q3) IC30.5(I5)
N$988: 9.6 IC30.13(O4) TP98.TP(PP)
N$989: 9.7 IC30.14(O3) TP99.TP(PP)
N$990: 10.6 JP17.2 TP108.TP(PP)
N$991: LED23.K(C) R242.1
N$992: LED19.A LED20.A LED21.A LED22.A LED24.A R243.1
N$993: Q34.1(B) R244.2
N$994: IC28.3(Q0) IC30.1(I1) IC30.2(I2) Q40.1(G) Q41.1(G)
N$995: IC28.14(Q1) IC30.6(I6)
N$996: 9.3 IC30.11(O6) TP95.TP(PP)
N$997: Q35.1(B) Q35.2(C) Q36.1(B) R239.1 R240.1 R264.1 X12.2
N$998: Q36.3(E) R246.2
N$999: Q35.3(E) R245.2
N$1000: IC31.7(B:+IN) R230.1 R247.1
N$1001: IC36.2(A:-IN) R228.2
N$1002: Q38.1(B) R248.2 R269.1
N$1003: Q39.3(D) R249.2
N$1004: IC29.2(VO) R222.2
N$1005: IC29.3(VI) Q37.2(C)
N$1006: IC33.5(CV) R252.2
N$1007: IC33.3(Q) IC34.4(A:A) IC34.12(B:A) R252.1
N$1008: D54.1(+) R253.1
N$1009: 9.10 D46.2(-) D47.2(-) JP20.1 SJ4.1 TP102.TP(PP)
N$1010: JP20.2 R254.2 R255.2 SJ4.2
N$1011: IC34.9(B:!Q) IC34.11(B:B) R258.2
N$1012: C47.1 IC34.14(B:T2) R256.1
N$1013: JP16.1 R257.2
N$1014: IC30.15(O2) R244.1
N$1015: 10.12 R258.1 TP115.TP(PP)
N$1016: D51.1(+) JP18.2
N$1017: IC36.1(A:OUT) R259.2
N$1018: C48.1 R259.1 R260.1
N$1019: IC36.5(B:+IN) Q41.3(D) R260.2 R261.2
N$1020: IC36.6(B:-IN) R262.1 R263.2
N$1021: D52.1(+) JP19.1
N$1022: JP17.3 R249.1
N$1023: IC31.13(D:OUT) JP17.1 Q39.1(G) R250.2
N$1024: R241.1 X10.21
N$1025: IC30.16(O1) Q40.3(D) R271.1
N$1026: D57.2(-) R274.1 R275.1
N$1027: 9.8 R271.2 TP100.TP(PP)
N$1028: Q40.2(S) R270.2
N$1029: D58.1(+) X10.1
N$1030: Q38.3(E) R268.1
N$1031: C45.2 D54.2(-) D59.C IC33.2(TR) IC33.6(THR) R251.1
N$1032: Q42.1(B) R272.1
N$1033: Q43.3(D) R272.2
N$1034: Q42.2(C) R223.2 SJMP4.2
N$1035: IC36.7(B:OUT) R241.2 R248.1 R261.1
N$1036: IC31.2(A:OUT) R235.1
N$1037: IC34.7(A:!Q) Q43.1(G)
N$1038: C49.2 IC34.2(A:T2) R273.1
V+: D57.1(+) Q34.3(E) Q37.3(E) Q42.3(E) SJMP4.1 X10.6 ; also sheet 2,3,4,5,7
VCC: 6V4.TP(PP) C41.1 IC31.3(P:V+) IC32.1(OUT) IC36.8(P:V+) R230.2 R233.2 R236.1 R243.2 R262.2 ; also sheet 2,3,4,5,7
Unconnected: IC28.4(Q7) IC28.5(Q9) IC28.7(Q6) IC28.9(Q8) IC33.7(DIS) IC34.6(A:Q) IC34.10(B:Q) X10.20 X10.24

### Notes on the sheet
- Externe Beschaltung
- Variante "eine LED leuchtet"
- Variante "alle LEDs bis und
   mit Gang X leuchten"
- Anzeige:
- Klemmleisten
  Ausgang:
- Gang 1
- DauerPlus
  Konstant-Strom für LEDs
  Gang 1
  Gang 2
  Gang 3
  Gang 4
  Gang 5
  Neutrallampe
  Blinker rechts
  Blinker zusammen
  Blinker links
  Masse
- Gang 1
- Gang 2
- Gang 2
- Gang 3
- Gang 3
- Gang 1 | Gang 2 | Gang 3 | Gang 4 | Gang 5
- Gang 4
- Gang 4 | Klemmleisten Ausgang:
- Gang 5
- Gang 5
- Zündugsplus
  Choke
  Öldrucklampe
  Temperaturlampe
  Ladekontrolllampe
  Tankgeber (100hm)
  ABS-Lampe
  Lampentest
  Warnlampe
  Fernlichtlampe
  Geschwindigkeitssignal
  Menütaster
- Stromquelle für Gang
  LEDs. Für mehr als 12mA
  muss ein Widerstand "R_user"
  eingelötet werden. Für weniger
  muss der 1kOhm SMD Widerstand
  neben R_user entfernt werden
  I = 12V/1kOhm(default)+12V/R_user
  I= 12mA (default) + 12V/R_user
  Beispiel:
  R_user      Strom in LEDs
  1 kOhm     22-26mA
  ohne       11-13mA
- Externe Beschaltung
- an Zündungsplus anhängen
  (Neutral leuchtet wenn Gang 0
  eingelegt und Zündschlüssel steckt )
- Neutrallampe
  für eigene
  Ganganzeige
- DauerPlus Batterie 12V (rot weiss)
  Ganganzeige Signal C (gelb weiss)
  Ganganzeige Signal B (gelb schwarz)
  Ganganzeige Signal A (gelb dunkelblau)
  12V/350mA zum Starknopf (schwarz grün)
  Zündungsplus 12V (grün schwarz)
  Reservelampe (weiss)
  ABS Leuchte (blau)
  Ladekontrollleuchte (schaltet auf Masse) (violett schwarz)
  Temperaturleuchte (schaltet auf Masse) (braun schwarz)
  Öldruckleuchte (schaltet auf Masse) (braun grün)
  Chokelampe (schaltet auf Masse) (violett weiss)
- BL resistors
- 1k
- an Ausgang "Neutrallampe" anhängen
- Masse (braun)
  Lampentest (schaltet auf Masse)(weiss blau)
  Fernlichtlampe (12V) (weiss)
  Drehzahl Zündspule (schwarz blau)
  Blinker rechts (blau scharz)
  Masse (braun)
  Blinker links (blau rot)
  nicht angeschlossen
  Tachosiganl zum Blinrelais (balu grün)
  Tachogeber (gelb)
  Masse Tachobeger (braun)
  Tachobeleuchtung (12V Zündungsplus) (grau blau)
- RES | BAR
- 4.7V | rising edge trigger A
- non retriggerable
- ZündungsPlus
- current source 96mA
- 6V regulated for Opamps
- nicht bestückt
- retriggerable
- Standard panel Fiducial | panel Fiducial with solder mask around fiducial

## Sheet 7 of 7
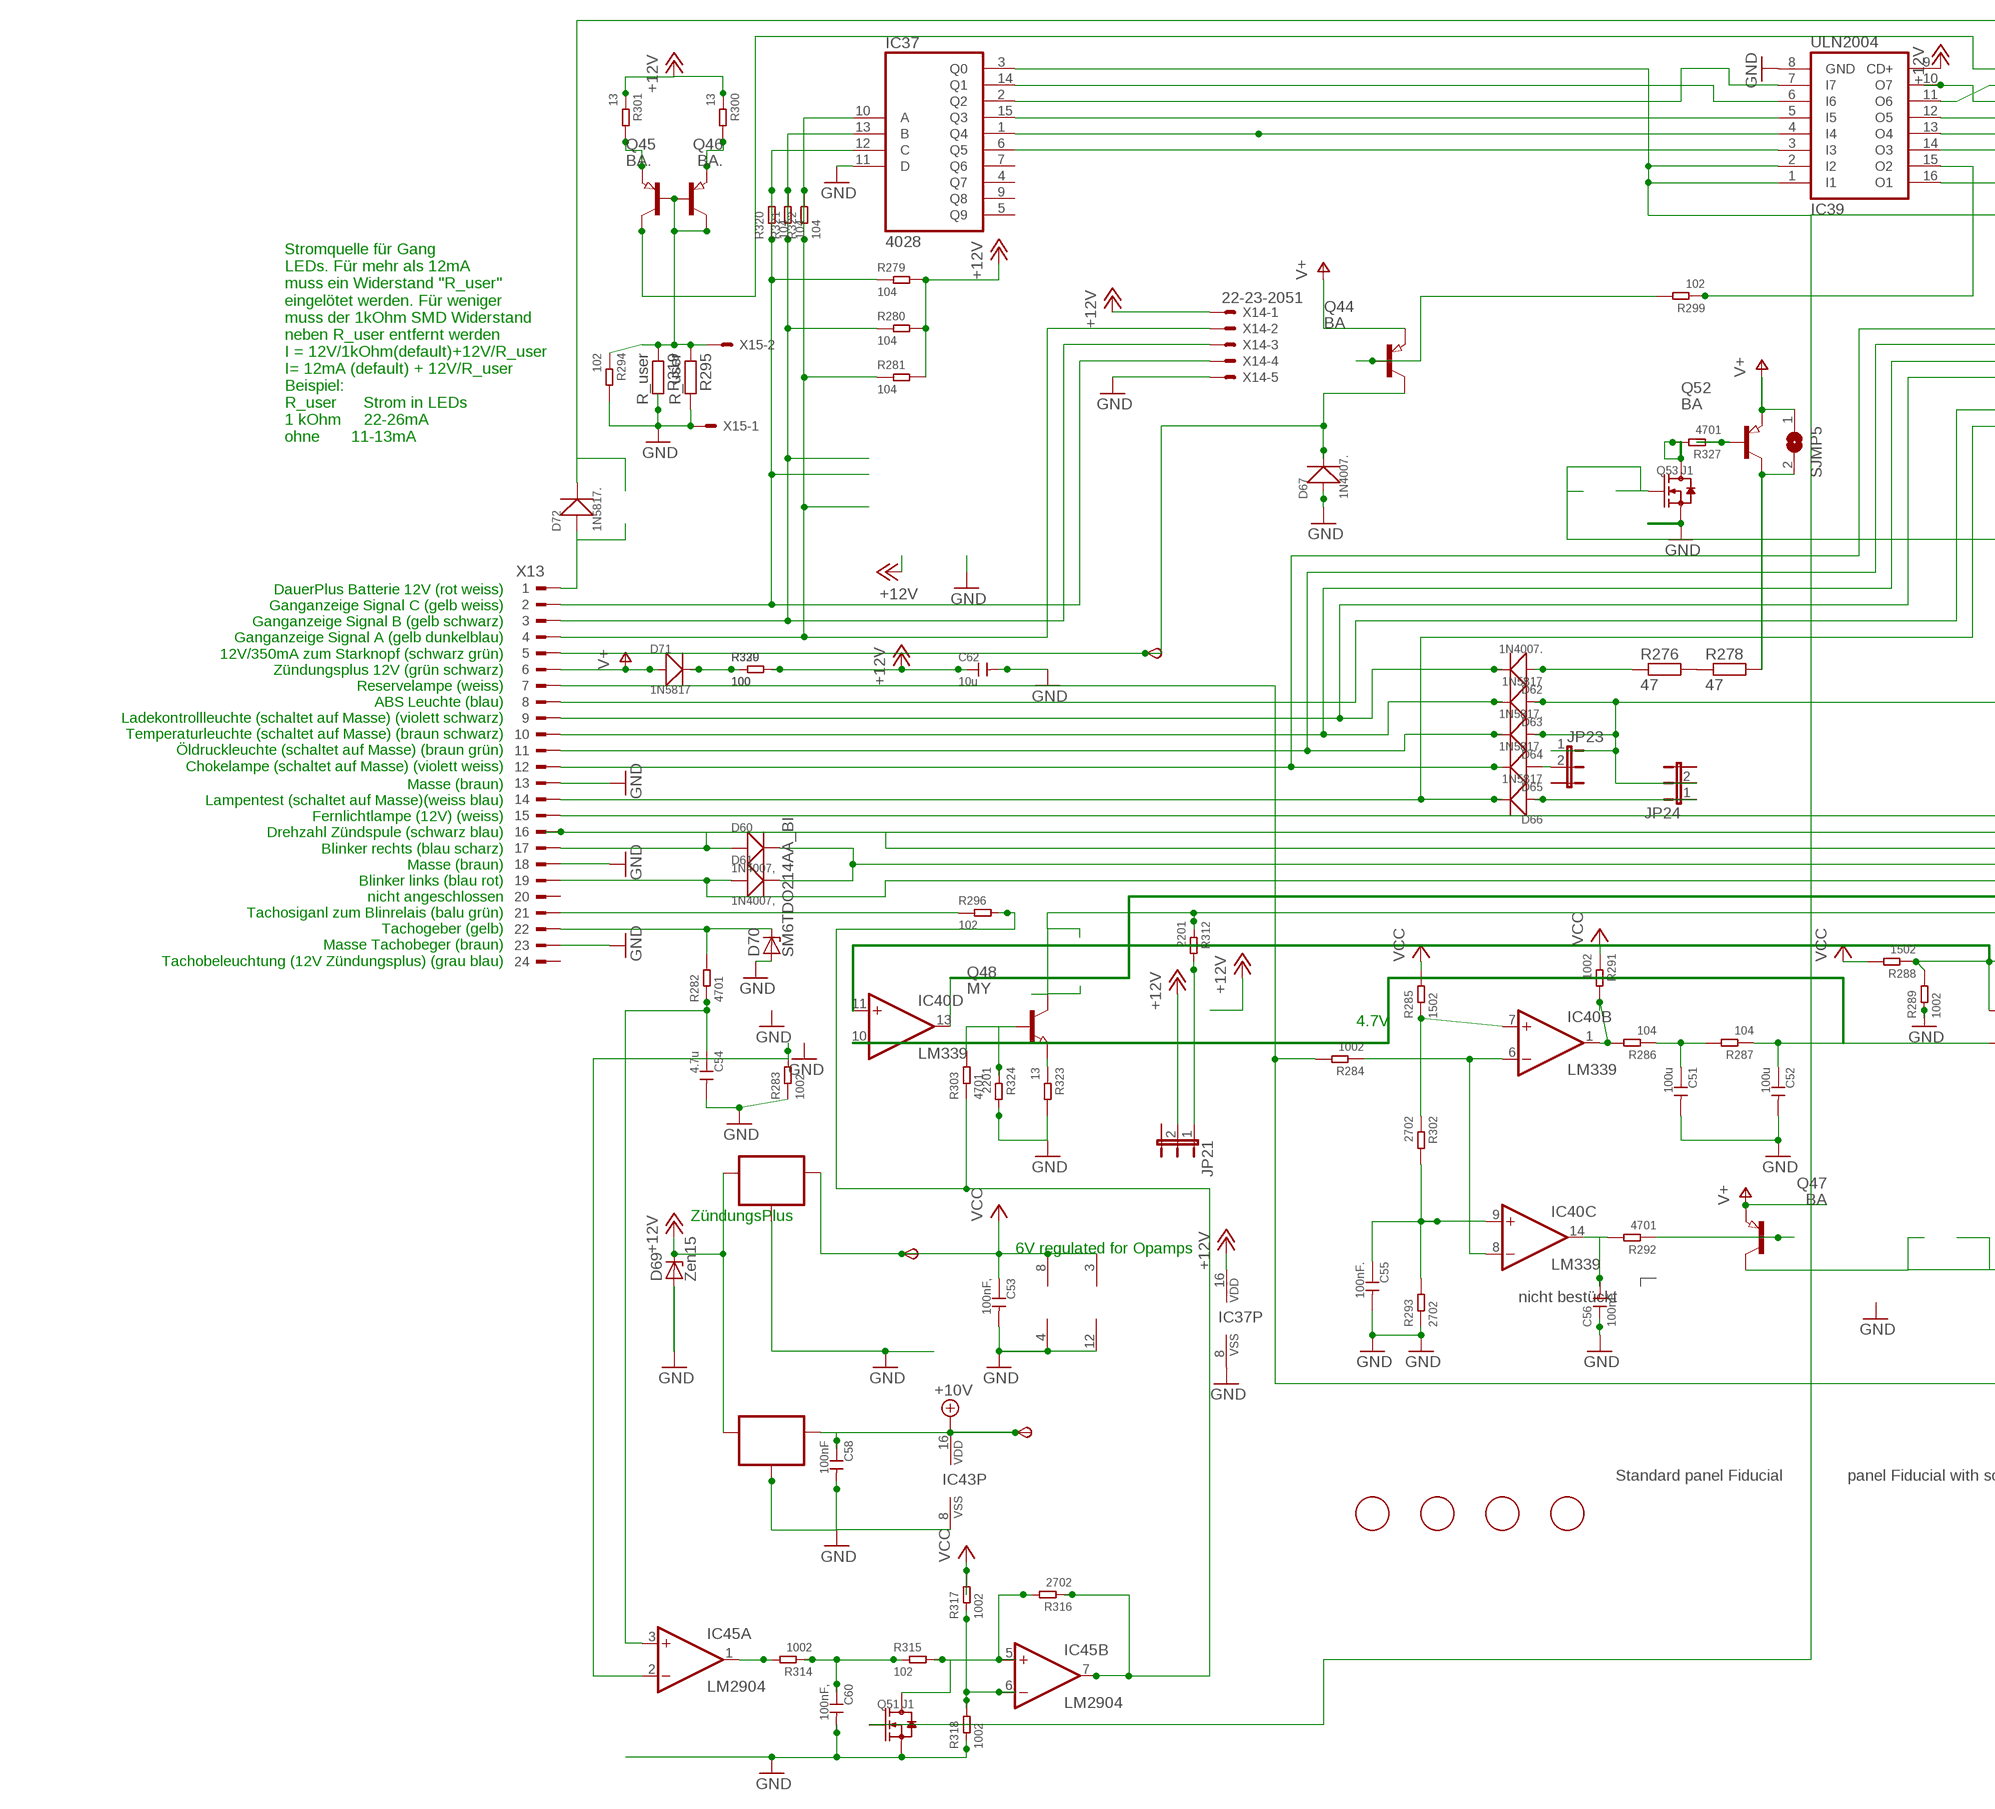
[diagram p11: schematic, sheet 7, part 1 of 2]
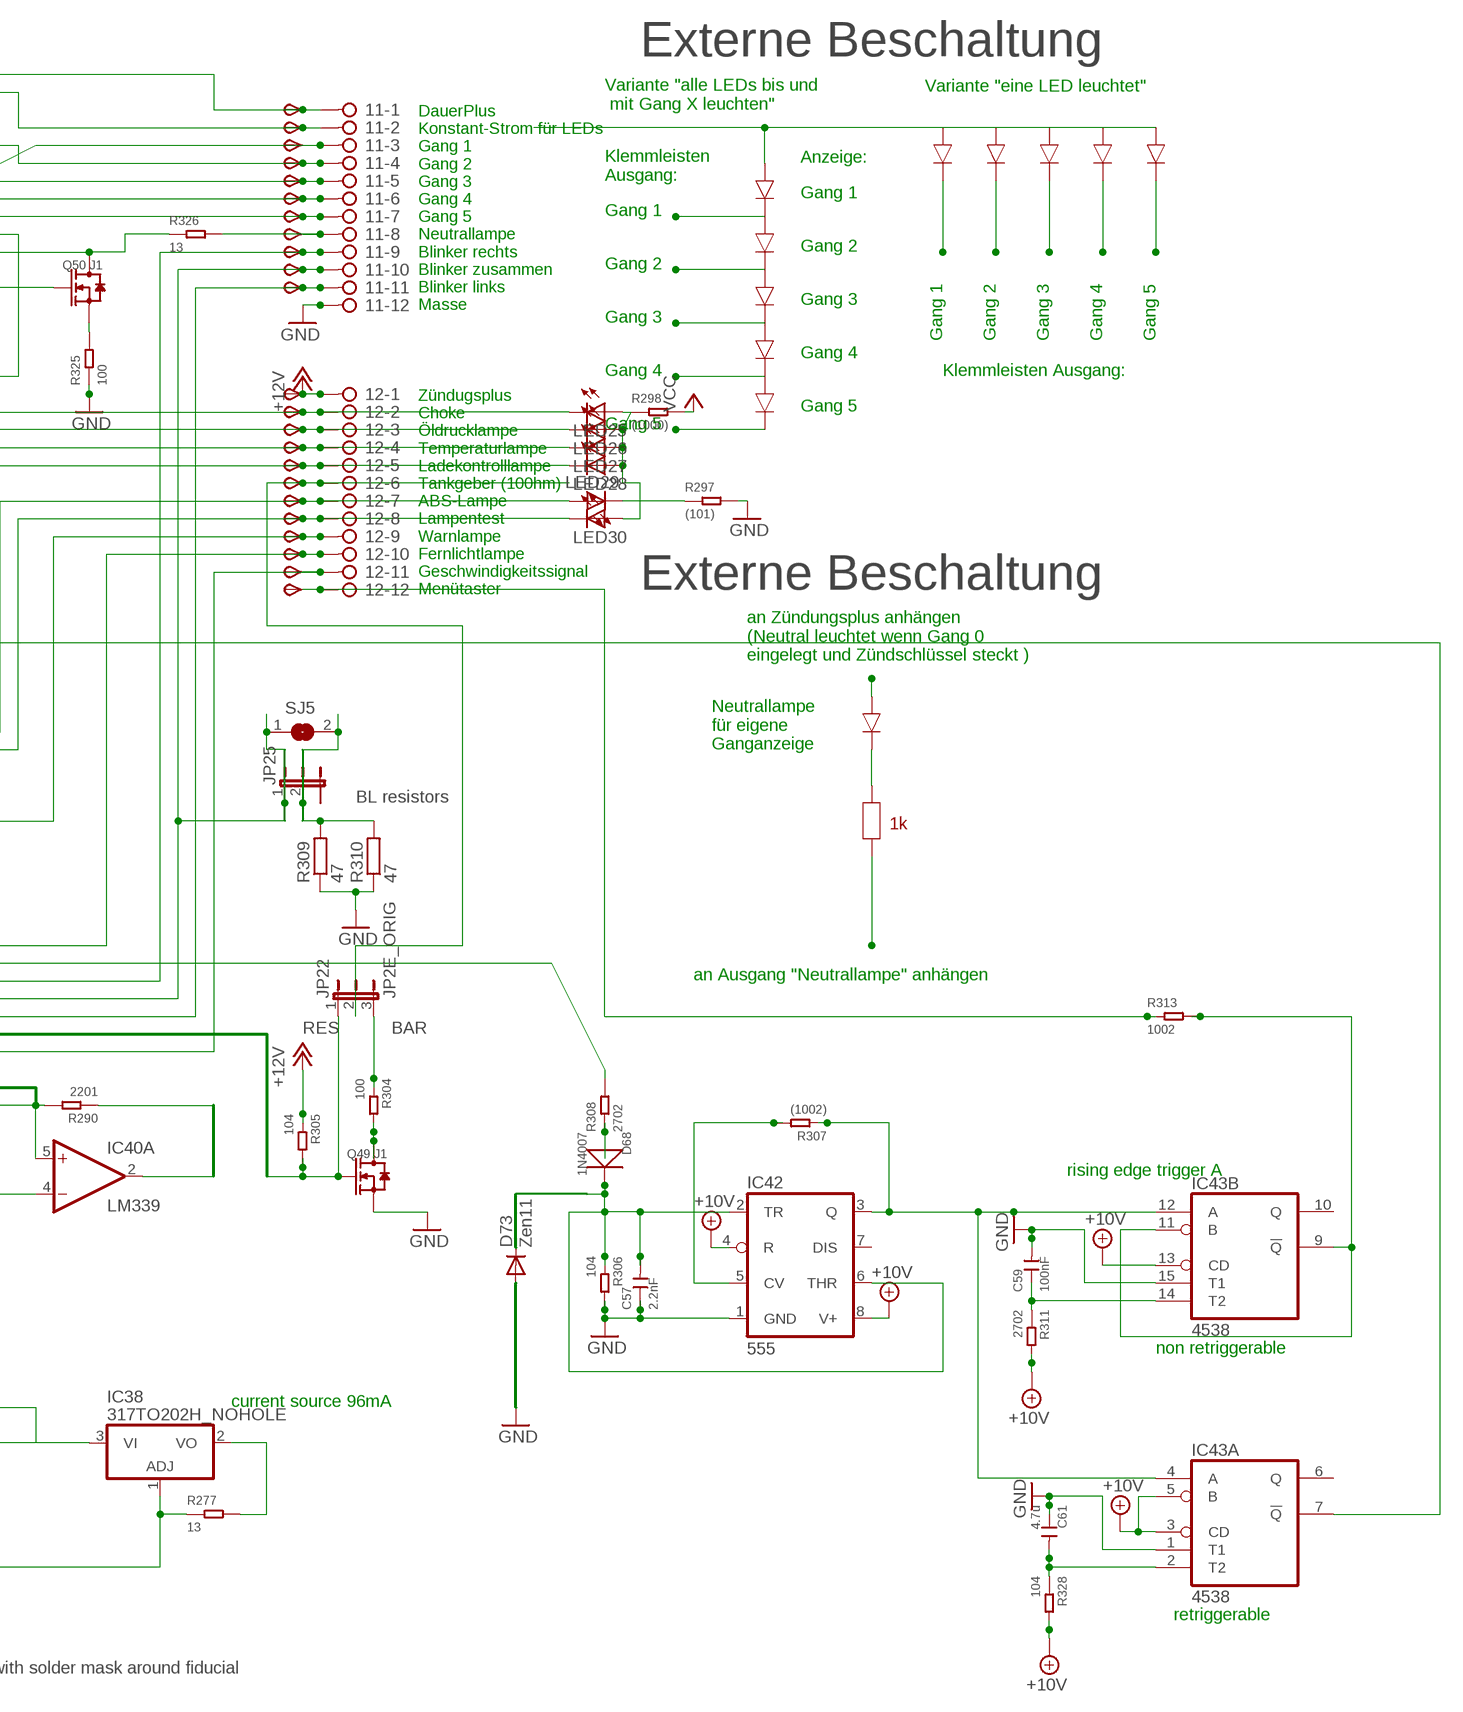
[diagram p12: schematic, sheet 7, part 2 of 2]

### Parts
6V5  TPSB2.0  [B2.0]
10V5  TPSB2.0  [B2.0]
11  2081-1132  [12-PIN]
12  2081-1132  [12-PIN]
C51  100u  CERAMIC-100UF-6.3V-20%-X5R(1206)  [C1206]
C52  100u  CERAMIC-100UF-6.3V-20%-X5R(1206)  [C1206]
C53  100nF,  CERAMIC-100NF-50V-10%-X7R(0805)  [C0805]
C54  4.7u  CERAMIC-4.7UF-25V-10%-X5R(0805)  [C0805]
C55  100nF.  CERAMIC-100NF-50V-10%-X7R(0805)  [C0805]
C56  100nF.  CERAMIC-100NF-50V-10%-X7R(0805)  [C0805]
C57  2.2nF  CERAMIC-100NF-50V-10%-X7R(0805)  [C0805]
C58  100nF  CERAMIC-100NF-50V-10%-X7R(0805)  [C0805]
C59  100nF  CERAMIC-100NF-50V-10%-X7R(0805)  [C0805]
C60  100nF,  CERAMIC-100NF-50V-10%-X7R(0805)  [C0805]
C61  4.7u  CERAMIC-4.7UF-25V-10%-X5R(0805)  [C0805]
C62  10u  CERAMIC-100UF-6.3V-20%-X5R(1206)  [C1206]
D60  1N4007,  DIODE-GEN-PURPOSE-1KV-1A(DO-214AC)  [DO-214AC]
D61  1N4007,  DIODE-GEN-PURPOSE-1KV-1A(DO-214AC)  [DO-214AC]
D62  1N4007.  DIODE-GEN-PURPOSE-1KV-1A(DO-214AC)  [DO-214AC]
D63  1N5817  DIODE-GEN-PURPOSE-1KV-1A(DO-214AC)DO-214AC/1206  [DO-214AC_SLIM]
D64  1N5817.  DIODE-GEN-PURPOSE-1KV-1A(DO-214AC)DO-214AC/1206  [DO-214AC_SLIM]
D65  1N5817.  DIODE-GEN-PURPOSE-1KV-1A(DO-214AC)DO-214AC/1206  [DO-214AC_SLIM]
D66  1N5817  DIODE-GEN-PURPOSE-1KV-1A(DO-214AC)DO-214AC/1206  [DO-214AC_SLIM]
D67  1N4007.  DIODE-GEN-PURPOSE-1KV-1A(DO-214AC)  [DO-214AC]
D68  1N4007  DIODE-GEN-PURPOSE-1KV-1A(DO-214AC)  [DO-214AC]
D69  Zen15  SM6T  [DO214AA]
D70  SM6TDO214AA_BI  [DO214AA_BI]
D71  1N5817  DIODE-GEN-PURPOSE-1KV-1A(DO-214AC)DO-214AC/1206  [DO-214AC_SLIM]
D72  1N5817.  DIODE-GEN-PURPOSE-1KV-1A(DO-214AC)DO-214AC/1206  [DO-214AC_SLIM]
D73  Zen11  CGRM4001-G  [SOD-123_MINI-SMA]
FID19  FIDUCIAL  [FIDUCIAL_1MM]
FID20  FIDUCIAL  [FIDUCIAL_1MM]
FID21  FIDUCIAL  [FIDUCIAL_1MM]
FID22  FIDUCIAL  [FIDUCIAL_1MM]
IC37  4028  4028D  [SO16]
IC38  317TO202H_NOHOLE  [TO220H_NOHOLE]
IC39  ULN2004  ULN2004AD  [SO16]
IC40  LM339  LM339D  [SO14]
IC41  78L06  78LXXSOT89_ROUND  [SOT89_ROUND]
IC42  555  NE555D  [SO08]
IC43  4538  4538D  [SO16]
IC44  78L10  78LXXSOT89_ROUND  [SOT89_ROUND]
IC45  LM2904  LM358D  [SO08]
JP21  JP2EJP2_SMALLPADS  [JP2_SMALLPADS]
JP22  JP2E_ORIG  [JP2_ORIG_SMALLPADS]
JP23  JP2EJP2_SMALLPADS  [JP2_SMALLPADS]
JP24  JP2EJP2_SMALLPADS  [JP2_SMALLPADS]
JP25  JP2EJP2_SMALLPADS  [JP2_SMALLPADS]
LED25  LEDLD260  [LD260]
LED26  LEDLD260  [LD260]
LED27  LEDLD260  [LD260]
LED28  LEDLD260  [LD260]
LED29  LEDLD260  [LD260]
LED30  LEDLD260  [LD260]
Q44  BA  PNP-TRANSISTOR_SOT89  [SOT89]
Q45  BA.  PNP-TRANSISTOR_SOT89  [SOT89]
Q46  BA.  PNP-TRANSISTOR_SOT89  [SOT89]
Q47  BA  PNP-TRANSISTOR_SOT89  [SOT89]
Q48  MY  NPN-TRANSISTOR_SOT89  [SOT89]
Q49  J1  SMD-MOSFET-N-CH-50V-200MA-BSS138W-7-F(SOT-23)  [SOT-23]
Q50  J1  SMD-MOSFET-N-CH-50V-200MA-BSS138W-7-F(SOT-23)  [SOT-23]
Q51  J1  SMD-MOSFET-N-CH-50V-200MA-BSS138W-7-F(SOT-23)  [SOT-23]
Q52  BA  PNP-TRANSISTOR_SOT89  [SOT89]
Q53  J1  SMD-MOSFET-N-CH-50V-200MA-BSS138W-7-F(SOT-23)  [SOT-23]
R276  47  R-EU_V235/17_1MM  [V235/17_1MM]
R277  13  SMD-RES-13R-5%-1/4W(1206)  [R1206]
R278  47  R-EU_V235/17_1MM  [V235/17_1MM]
R279  104  SMD-RES-10K-1%-1/8W(0805)  [R0805]
R280  104  SMD-RES-10K-1%-1/8W(0805)  [R0805]
R281  104  SMD-RES-10K-1%-1/8W(0805)  [R0805]
R282  4701  SMD-RES-4.7K-5%-1/8W(0805)  [R0805]
R283  1002  SMD-RES-10K-1%-1/8W(0805)  [R0805]
R284  1002  SMD-RES-10K-1%-1/8W(0805)  [R0805]
R285  1502  SMD-RES-10K-1%-1/8W(0805)  [R0805]
R286  104  SMD-RES-10K-1%-1/8W(0805)  [R0805]
R287  104  SMD-RES-10K-1%-1/8W(0805)  [R0805]
R288  1502  SMD-RES-10K-1%-1/8W(0805)  [R0805]
R289  1002  SMD-RES-10K-1%-1/8W(0805)  [R0805]
R290  2201  SMD-RES-2.2K-5%-1/8W(0805)  [R0805]
R291  1002  SMD-RES-10K-1%-1/8W(0805)  [R0805]
R292  4701  SMD-RES-4.7K-5%-1/8W(0805)  [R0805]
R293  2702  SMD-RES-4.7K-5%-1/8W(0805)  [R0805]
R294  102  SMD-RES-1K-5%-1/8W(0805)  [R0805]
R295  R_user  R-EU_R0805  [R0805]
R296  102  SMD-RES-220R-5%-1/8W(0805)  [R0805]
R297  (101)  SMD-RES-100R-5%-1/8W(0805)  [R0805]
R298  (1000)  SMD-RES-100R-5%-1/8W(0805)  [R0805]
R299  102  SMD-RES-1K-5%-1/8W(0805)  [R0805]
R300  13  SMD-RES-13R-5%-1/4W(1206)  [R1206]
R301  13  SMD-RES-13R-5%-1/4W(1206)  [R1206]
R302  2702  SMD-RES-4.7K-5%-1/8W(0805)  [R0805]
R303  4701  SMD-RES-4.7K-5%-1/8W(0805)  [R0805]
R304  100  SMD-RES-2.2K-5%-1/8W(0805)  [R0805]
R305  104  SMD-RES-10K-1%-1/8W(0805)  [R0805]
R306  104  SMD-RES-10K-1%-1/8W(0805)  [R0805]
R307  (1002)  SMD-RES-10K-1%-1/8W(0805)  [R0805]
R308  2702  SMD-RES-10K-1%-1/8W(0805)  [R0805]
R309  47  R-EU_V235/17_1MM  [V235/17_1MM]
R310  47  R-EU_V235/17_1MM  [V235/17_1MM]
R311  2702  SMD-RES-4.7K-5%-1/8W(0805)  [R0805]
R312  2201  SMD-RES-2.2K-5%-1/8W(0805)  [R0805]
R313  1002  SMD-RES-4.7K-5%-1/8W(0805)  [R0805]
R314  1002  SMD-RES-10K-1%-1/8W(0805)  [R0805]
R315  102  SMD-RES-1K-5%-1/8W(0805)  [R0805]
R316  2702  SMD-RES-4.7K-5%-1/8W(0805)  [R0805]
R317  1002  SMD-RES-1K-5%-1/8W(0805)  [R0805]
R318  1002  SMD-RES-1K-5%-1/8W(0805)  [R0805]
R319  R_user  R-EU_R0805  [R0805]
R320  104  SMD-RES-10K-1%-1/8W(0805)  [R0805]
R321  104  SMD-RES-10K-1%-1/8W(0805)  [R0805]
R322  104  SMD-RES-10K-1%-1/8W(0805)  [R0805]
R323  13  SMD-RES-13R-5%-1/4W(1206)  [R1206]
R324  2201  SMD-RES-1K-5%-1/8W(0805)  [R0805]
R325  100  SMD-RES-220R-5%-1/8W(0805)  [R0805]
R326  13  SMD-RES-13R-5%-1/4W(1206)  [R1206]
R327  4701  SMD-RES-4.7K-5%-1/8W(0805)  [R0805]
R328  104  SMD-RES-4.7K-5%-1/8W(0805)  [R0805]
R329  100  SMD-RES-2.2K-5%-1/8W(0805)  [R0805]
R330  100  SMD-RES-2.2K-5%-1/8W(0805)  [R0805]
SJ5  SJ  [SJ]
SJMP5  SJ  [SJ]
START5  TPSB2.0  [B2.0]
TP116  TPSB2.0  [B2.0]
TP117  TPSB2.0  [B2.0]
TP118  TPSB2.0  [B2.0]
TP119  TPSB2.0  [B2.0]
TP120  TPSB2.0  [B2.0]
TP121  TPSB2.0  [B2.0]
TP122  TPSB2.0  [B2.0]
TP123  TPSB2.0  [B2.0]
TP124  TPSB2.0  [B2.0]
TP125  TPSB2.0  [B2.0]
TP126  TPSB2.0  [B2.0]
TP127  TPSB2.0  [B2.0]
TP128  TPSB2.0  [B2.0]
TP129  TPSB2.0  [B2.0]
TP130  TPSB2.0  [B2.0]
TP131  TPSB2.0  [B2.0]
TP132  TPSB2.0  [B2.0]
TP133  TPSB2.0  [B2.0]
TP134  TPSB1,27  [B1,27]
TP135  TPSB2.0  [B2.0]
TP136  TPSB2.0  [B2.0]
TP137  TPSB2.0  [B2.0]
TP138  TPSB2.0  [B2.0]
X13  CON_BMWV2  [24-PIN_V2]
X14  22-23-2051  [22-23-2051]
X15  22-23-2021  [22-23-2021]

### Nets
+10V: 10V5.TP(PP) C58.1 IC42.4(R) IC42.8(V+) IC43.3(A:CD) IC43.5(A:B) IC43.13(B:CD) IC43.16(P:VDD) IC44.1(OUT) R311.2 R328.2 ; also sheet 2,3,4,5,6
+12V: 12.1 C62.1 D69.C IC37.16(VDD) IC39.9(CD+) IC41.3(IN) IC44.3(IN) JP21.2 R279.2 R280.2 R281.2 R300.1 R301.1 R305.1 R329.2 R330.2 TP137.TP(PP) X14.1 ; also sheet 2,3,4,5,6
+12V6: 12.11 Q48.2(C) R312.1 TP136.TP(PP)
GND: 11.12 C51.2 C52.2 C53.2 C54.2 C55.2 C56.1 C57.1 C58.2 C59.2 C60.2 C61.1 C62.2 D67.1(+) D69.A D70.A D73.A IC37.8(VSS) IC37.11(D) IC39.8(GND) IC40.12(P:GND) IC41.2(GND) IC41.2@1(GND) IC42.1(GND) IC43.1(A:T1) IC43.8(P:VSS) IC43.15(B:T1) IC44.2(GND) IC44.2@1(GND) IC45.4(P:V-) Q49.2(S) Q51.2(S) Q53.2(S) R283.1 R289.1 R293.1 R294.2 R295.2 R297.2 R306.2 R309.1 R310.1 R318.1 R319.2 R323.2 R324.2 R325.1 X13.13 X13.18 X13.23 X14.5 X15.1 ; also sheet 2,3,4,5,6
N$1162: R276.2 R278.1
N$1163: 12.9 D63.1(+) D64.1(+) JP23.1 JP24.2 TP134.TP(PP)
N$1164: IC37.10(A) R281.1 R322.1 R322.2 X13.4 X14.2
N$1165: IC37.13(B) R280.1 R321.1 R321.2 X13.3 X14.3
N$1166: D67.2(-) Q44.2(C) START5.TP(PP) X13.5
N$1167: IC37.12(C) R279.1 R320.1 R320.2 X13.2 X14.4
N$1173: 12.7 LED29.A TP132.TP(PP) X13.8
N$1174: 12.2 D65.2(-) LED25.K(C) TP127.TP(PP) X13.12
N$1180: 12.3 D64.2(-) LED26.K(C) TP128.TP(PP) X13.11
N$1181: 12.4 D63.2(-) LED27.K(C) TP129.TP(PP) X13.10
N$1187: 12.8 D66.2(-) LED30.K(C) TP133.TP(PP) X13.14
N$1188: 11.9 D60.1(+) TP124.TP(PP) X13.17
N$1189: 11.11 D61.1(+) TP126.TP(PP) X13.19
N$1190: D70.C R282.2 X13.22
N$1191: C54.1 IC45.3(A:+IN) R282.1
N$1192: IC40.1(B:OUT) R286.2 R291.2
N$1193: C51.1 R286.1 R287.2
N$1194: C52.1 IC40.4(A:-IN) IC40.10(D:-IN) R287.1
N$1195: IC40.5(A:+IN) IC40.11(D:+IN) R288.1 R289.2 R290.2
N$1196: C55.1 IC40.9(C:+IN) R293.2 R302.2
N$1197: C56.2 IC40.14(C:OUT) R292.2
N$1198: Q47.1(B) R292.1
N$1199: IC37.2(Q2) IC39.7(I7)
N$1200: 11.5 IC39.12(O5) TP120.TP(PP)
N$1201: IC37.1(Q4) IC39.4(I4)
N$1202: 12.10 TP135.TP(PP) X13.15
N$1203: 12.5 D62.2(-) LED28.K(C) TP130.TP(PP) X13.9
N$1204: D62.1(+) R276.1
N$1205: IC37.6(Q5) IC39.3(I3)
N$1206: 11.4 IC39.10(O7) TP119.TP(PP)
N$1207: IC38.1(ADJ) R277.1 R284.2 X13.7
N$1208: IC40.6(B:-IN) IC40.8(C:-IN) R284.1
N$1209: 11.2 Q46.2(C) TP117.TP(PP)
N$1210: 11.1 D72.2(-) TP116.TP(PP)
N$1224: R308.2 X13.16
N$1225: IC37.15(Q3) IC39.5(I5)
N$1226: 11.6 IC39.13(O4) TP121.TP(PP)
N$1227: 11.7 IC39.14(O3) TP122.TP(PP)
N$1228: 12.6 JP22.2 TP131.TP(PP)
N$1229: LED29.K(C) R297.1
N$1230: LED25.A LED26.A LED27.A LED28.A LED30.A R298.1
N$1231: Q44.1(B) R299.2
N$1232: IC37.3(Q0) IC39.1(I1) IC39.2(I2) Q50.1(G) Q51.1(G)
N$1233: IC37.14(Q1) IC39.6(I6)
N$1234: 11.3 IC39.11(O6) TP118.TP(PP)
N$1235: Q45.1(B) Q45.2(C) Q46.1(B) R294.1 R295.1 R319.1 X15.2
N$1236: Q46.3(E) R301.2
N$1237: Q45.3(E) R300.2
N$1238: IC40.7(B:+IN) R285.1 R302.1
N$1239: IC45.2(A:-IN) R283.2
N$1240: Q48.1(B) R303.2 R324.1
N$1241: Q49.3(D) R304.2
N$1242: IC38.2(VO) R277.2
N$1243: IC38.3(VI) Q47.2(C)
N$1244: IC42.5(CV) R307.2
N$1245: IC42.3(Q) IC43.4(A:A) IC43.12(B:A) R307.1
N$1246: D68.1(+) R308.1
N$1247: 11.10 D60.2(-) D61.2(-) JP25.1 SJ5.1 TP125.TP(PP)
N$1248: JP25.2 R309.2 R310.2 SJ5.2
N$1249: IC43.9(B:!Q) IC43.11(B:B) R313.2
N$1250: C59.1 IC43.14(B:T2) R311.1
N$1251: JP21.1 R312.2
N$1252: IC39.15(O2) R299.1
N$1253: 12.12 R313.1 TP138.TP(PP)
N$1254: D65.1(+) JP23.2
N$1255: IC45.1(A:OUT) R314.2
N$1256: C60.1 R314.1 R315.1
N$1257: IC45.5(B:+IN) Q51.3(D) R315.2 R316.2
N$1258: IC45.6(B:-IN) R317.1 R318.2
N$1259: D66.1(+) JP24.1
N$1260: JP22.3 R304.1
N$1261: IC40.13(D:OUT) JP22.1 Q49.1(G) R305.2
N$1262: R296.1 X13.21
N$1263: IC39.16(O1) Q50.3(D) R326.1
N$1264: D71.2(-) R329.1 R330.1
N$1265: 11.8 R326.2 TP123.TP(PP)
N$1266: Q50.2(S) R325.2
N$1267: D72.1(+) X13.1
N$1268: Q48.3(E) R323.1
N$1269: C57.2 D68.2(-) D73.C IC42.2(TR) IC42.6(THR) R306.1
N$1270: Q52.1(B) R327.1
N$1271: Q53.3(D) R327.2
N$1272: Q52.2(C) R278.2 SJMP5.2
N$1273: IC45.7(B:OUT) R296.2 R303.1 R316.1
N$1274: IC40.2(A:OUT) R290.1
N$1275: IC43.7(A:!Q) Q53.1(G)
N$1276: C61.2 IC43.2(A:T2) R328.1
V+: D71.1(+) Q44.3(E) Q47.3(E) Q52.3(E) SJMP5.1 X13.6 ; also sheet 2,3,4,5,6
VCC: 6V5.TP(PP) C53.1 IC40.3(P:V+) IC41.1(OUT) IC45.8(P:V+) R285.2 R288.2 R291.1 R298.2 R317.2 ; also sheet 2,3,4,5,6
Unconnected: IC37.4(Q7) IC37.5(Q9) IC37.7(Q6) IC37.9(Q8) IC42.7(DIS) IC43.6(A:Q) IC43.10(B:Q) X13.20 X13.24

### Notes on the sheet
- Externe Beschaltung
- Variante "eine LED leuchtet"
- Variante "alle LEDs bis und
   mit Gang X leuchten"
- Anzeige:
- Klemmleisten
  Ausgang:
- Gang 1
- DauerPlus
  Konstant-Strom für LEDs
  Gang 1
  Gang 2
  Gang 3
  Gang 4
  Gang 5
  Neutrallampe
  Blinker rechts
  Blinker zusammen
  Blinker links
  Masse
- Gang 1
- Gang 2
- Gang 2
- Gang 3
- Gang 3
- Gang 1 | Gang 2 | Gang 3 | Gang 4 | Gang 5
- Gang 4
- Gang 4 | Klemmleisten Ausgang:
- Gang 5
- Gang 5
- Zündugsplus
  Choke
  Öldrucklampe
  Temperaturlampe
  Ladekontrolllampe
  Tankgeber (100hm)
  ABS-Lampe
  Lampentest
  Warnlampe
  Fernlichtlampe
  Geschwindigkeitssignal
  Menütaster
- Stromquelle für Gang
  LEDs. Für mehr als 12mA
  muss ein Widerstand "R_user"
  eingelötet werden. Für weniger
  muss der 1kOhm SMD Widerstand
  neben R_user entfernt werden
  I = 12V/1kOhm(default)+12V/R_user
  I= 12mA (default) + 12V/R_user
  Beispiel:
  R_user      Strom in LEDs
  1 kOhm     22-26mA
  ohne       11-13mA
- Externe Beschaltung
- an Zündungsplus anhängen
  (Neutral leuchtet wenn Gang 0
  eingelegt und Zündschlüssel steckt )
- Neutrallampe
  für eigene
  Ganganzeige
- DauerPlus Batterie 12V (rot weiss)
  Ganganzeige Signal C (gelb weiss)
  Ganganzeige Signal B (gelb schwarz)
  Ganganzeige Signal A (gelb dunkelblau)
  12V/350mA zum Starknopf (schwarz grün)
  Zündungsplus 12V (grün schwarz)
  Reservelampe (weiss)
  ABS Leuchte (blau)
  Ladekontrollleuchte (schaltet auf Masse) (violett schwarz)
  Temperaturleuchte (schaltet auf Masse) (braun schwarz)
  Öldruckleuchte (schaltet auf Masse) (braun grün)
  Chokelampe (schaltet auf Masse) (violett weiss)
- BL resistors
- 1k
- an Ausgang "Neutrallampe" anhängen
- Masse (braun)
  Lampentest (schaltet auf Masse)(weiss blau)
  Fernlichtlampe (12V) (weiss)
  Drehzahl Zündspule (schwarz blau)
  Blinker rechts (blau scharz)
  Masse (braun)
  Blinker links (blau rot)
  nicht angeschlossen
  Tachosiganl zum Blinrelais (balu grün)
  Tachogeber (gelb)
  Masse Tachobeger (braun)
  Tachobeleuchtung (12V Zündungsplus) (grau blau)
- RES | BAR
- 4.7V | rising edge trigger A
- non retriggerable
- ZündungsPlus
- current source 96mA
- 6V regulated for Opamps
- nicht bestückt
- retriggerable
- Standard panel Fiducial | panel Fiducial with solder mask around fiducial

## Library data of the parts
1-12 = con WAGO BMW:2081-1132: WAGO SREW CLAMP
6V 6V1-6V5 10V 10V1-10V5 START START1-START5 TP1-TP138 = testpin_BMW:TPS: TEST PIN
C1-C3 C13 C14 C16 C26-C28 C38-C40 C50-C52 C62 C107 C108 = Seeed-Capacitor-2016:CERAMIC-100UF-6.3V-20%-X5R(1206): 302010183; MPN: GRM31CR60J107ME39L; VALUE: 100uf
C4 C6-C11 C17 C19-C24 C29 C31-C36 C41 C43-C48 C53 C55-C60 C102-C106 C109 C110 = Seeed-Capacitor-2016:CERAMIC-100NF-50V-10%-X7R(0805): 302010165; MPN: CC0805KRX7R9BB104; VALUE: 100nf
C5 C12 C15 C18 C25 C30 C37 C42 C49 C54 C61 C101 = Seeed-Capacitor-2016:CERAMIC-4.7UF-25V-10%-X5R(0805): 302010146; MPN: CC0805KKX5R8BB475; VALUE: 4.7uf
D1 D2 D7-D10 D15 D16 D21-D24 D29 D30 D35-D38 D43 D44 D49-D52 D57 D58 D63-D66 D71 D72 D107-D110 = Diode-do214ac:DIODE-GEN-PURPOSE-1KV-1A(DO-214AC): 304010013
D3 D5 D6 D11 D18-D20 D25 D32-D34 D39 D46-D48 D53 D60-D62 D67 D102 D103 D105 D106 = Diode-do214ac:DIODE-GEN-PURPOSE-1KV-1A(DO-214AC): 304010013; MPN: 1N4007; VALUE: 1N4007
D4 D17 D31 D45 D59 D73 = diode:CGRM400*-G: Molded plasitc,JEDEC SOD-123/Mini SMA Source: Comchip CGRM4001-G.pdf
D12 D26 D40 D54 D68 D112 = Diode-do214ac:DIODE-GEN-PURPOSE-1KV-1A(DO-214AC): 304010013; MPN: 1N4007
D13 D14 D27 D28 D41 D42 D55 D56 D69 D70 D101 D104 = Suppressor_Diode_DO214AA:SM6T: Z DIODE
FID1 FID1B FID2 FID2B FID3-FID22 FID101-FID104 = Fiducial:FIDUCIAL: For use by pick and place machines to calibrate the vision/machine, 1mm By microbuilder.eu
IC1 IC10 IC19 IC28 IC37 IC105 = 4028:4028: BCD to decimal DECODER
IC2 IC11 IC20 IC29 IC38 IC109 = linear_BMW:*317: Positive VOLTAGE REGULATOR
IC3 IC12 IC21 IC30 IC39 IC107 = uln-udn:ULN2004A: DRIVER ARRAY
IC4 IC13 IC22 IC31 IC40 IC108 = LM339:LM339: Low Power Low Offset Voltage Quad Comparators with open collector; LM139/LM239/LM339/LM2901/LM3302
IC5 IC8 IC14 IC17 IC23 IC26 IC32 IC35 IC41 IC44 IC102 IC104 = 78LXX:78LXX
IC6 IC15 IC24 IC33 IC42 IC110 = linear:*555: TIMER
IC7 IC16 IC25 IC34 IC43 IC111 = 45xx:4538: Dual precision monostable MULTIVIBRATOR
IC9 IC18 IC27 IC36 IC45 IC101 = linear_BMW:LM358: OP AMP also LM158; LM258; LM2904 Source: http://cache.national.com/ds/LM/LM158.pdf
JP1 JP3-JP6 JP8-JP11 JP13-JP16 JP18-JP21 JP23-JP25 JP101-JP104 = Switch Aliexpress 2:JP2E: JUMPER
JP2 JP7 JP12 JP17 JP22 JP105 = Switch Aliexpress 2:JP2E_ORIG
LED1-LED30 LED101-LED106 = led:LED: LED OSRAM: - CHIPLED LG R971, LG N971, LY N971, LG Q971, LY Q971, LO R971, LY R971 LH N974, LH R974 LS Q976, LO Q976, LY Q976 LO Q996 - Hyper CHIPLED LW Q18S LB Q993, LB Q99A, LB R99A - SideLED LS A670, LO A670, LY A670, LG A670, LP A670 LB A673, LV A673, LT A673, LW A673 LH A674 LY A675 LS A676, LA A676, LO A676, LY A676, LW A676 LS A679, LY A679, LG A679 - Hyper Micro SIDELED® LS Y876, LA Y876, LO Y876, LY Y876 LT Y87S - SmartLED LW L88C, LW L88S LB L89C, LB L89S, LG L890 LS L89K, LO L89K, LY L89K LS L896, LA L896, LO L896, LY L896 - TOPLED LS T670, LO T670, LY T670, LG T670, LP T670 LSG T670, LSP T670, LSY T670, LOP T670, LYG T670 LG T671, LOG T671, LSG T671 LB T673, LV T673, LT T673, LW T673 LH T674 LS T676, LA T676, LO T676, LY T676, LB T676, LH T676, LSB T676, LW T676 LB T67C, LV T67C, LT T67C, LS T67K, LO T67K, LY T67K, LW E67C LS E67B, LA E67B, LO E67B, LY E67B, LB E67C, LV E67C, LT E67C LW T67C LS T679, LY T679, LG T679 LS T770, LO T770, LY T770, LG T770, LP T770 LB T773, LV T773, LT T773, LW T773 LH T774 LS E675, LA E675, LY E675, LS T675 LS T776, LA T776, LO T776, LY T776, LB T776 LHGB T686 LT T68C, LB T68C - Hyper Mini TOPLED® LB M676 - Mini TOPLED Santana® LG M470 LS M47K, LO M47K, LY M47K Source: http://www.osram.convergy.de LUXEON: - LUMILED® LXK2-PW12-R00, LXK2-PW12-S00, LXK2-PW14-U00, LXK2-PW14-V00 LXK2-PM12-R00, LXK2-PM12-S00, LXK2-PM14-U00 LXK2-PE12-Q00, LXK2-PE12-R00, LXK2-PE12-S00, LXK2-PE14-T00, LXK2-PE14-U00 LXK2-PB12-K00, LXK2-PB12-L00, LXK2-PB12-M00, LXK2-PB14-N00, LXK2-PB14-P00, LXK2-PB14-Q00 LXK2-PR12-L00, LXK2-PR12-M00, LXK2-PR14-Q00, LXK2-PR14-R00 LXK2-PD12-Q00, LXK2-PD12-R00, LXK2-PD12-S00 LXK2-PH12-R00, LXK2-PH12-S00 LXK2-PL12-P00, LXK2-PL12-Q00, LXK2-PL12-R00 Source: www.luxeon.com KINGBRIGHT: KA-3528ASYC Source: www.kingbright.com
Q1 Q3 Q9-Q11 Q13 Q19-Q21 Q23 Q29-Q31 Q33 Q39-Q41 Q43 Q49-Q51 Q53 Q106 Q107 = Seeed-Transistor-2016:SMD-MOSFET-N-CH-50V-200MA-BSS138W-7-F(SOT-23): 305030000; MPN: BSS138W-7-F; VALUE: BSS138W-7-F
Q2 Q4-Q7 Q12 Q14-Q17 Q22 Q24-Q27 Q32 Q34-Q37 Q42 Q44-Q47 Q52 Q101 Q102 Q104 Q105 = Transistor_SOT89:PNP-TRANSISTOR_: PNP TRANSISTOR
Q8 Q18 Q28 Q38 Q48 Q103 = Transistor_SOT89:NPN-TRANSISTOR_: NPN TRANSISTOR
R1-R3 R15-R17 R19-R25 R27 R41-R44 R50 R56-R58 R70-R72 R74-R80 R82 R96-R99 R107-R111 R120 R121 R124 R125 R130-R132 R135 R140 R141 R144 R149 R155-R157 R169-R171 R173-R179 R181 R195-R198 R204 R210-R212 R224-R226 R228-R234 R236 R250-R253 R259 R265-R267 R279-R281 R283-R289 R291 R305-R308 R314 R320-R322 = Seeed-Resistor-2016:SMD-RES-10K-1%-1/8W(0805): 301010361; MPN: RC0805FR-0710KL; VALUE: 10K
R4 R32 R61 R87 R115 R160 R186 R215 R241 R270 R296 R325 = Seeed-Resistor-2016:SMD-RES-220R-5%-1/8W(0805): 301010315; MPN: RC0805JR-07220RL; VALUE: 220R
R5 R9 R11 R36 R37 R59 R62 R68 R91 R92 R102 R106 R134 R158 R161 R167 R190 R191 R213 R216 R222 R245 R246 R268 R271 R277 R300 R301 R323 R326 = Seeed-Resistor-2016:SMD-RES-13R-5%-1/4W(1206): 301010405; MPN: RC1206JR-0713RL; VALUE: 13R
R6 R30 R35 R51 R53 R54 R60 R85 R90 R101 R112-R114 R128 R150 R152 R153 R159 R184 R189 R205 R207 R208 R214 R239 R244 R260 R262 R263 R269 R294 R299 R315 R317 R318 R324 = Seeed-Resistor-2016:SMD-RES-1K-5%-1/8W(0805): 301010311; MPN: RC0805JR-071KL; VALUE: 1K
R7 R14 R31 R45 R46 R55 R67 R69 R86 R100 R103 R104 R118 R127 R129 R136 R137 R154 R166 R168 R185 R199 R200 R209 R221 R223 R240 R254 R255 R264 R276 R278 R295 R309 R310 R319 = rcl:R-EU_: RESISTOR, European symbol
R8 R10 R18 R28 R29 R38 R39 R47 R49 R52 R63 R64 R73 R83 R84 R93 R94 R105 R116 R117 R122 R123 R126 R139 R145 R146 R148 R151 R162 R163 R172 R182 R183 R192 R193 R201 R203 R206 R217 R218 R227 R237 R238 R247 R248 R256 R258 R261 R272 R273 R282 R292 R293 R302 R303 R311 R313 R316 R327 R328 = Seeed-Resistor-2016:SMD-RES-4.7K-5%-1/8W(0805): 301010306; MPN: RC0805JR-074K7L; VALUE: 4.7K
R12 R13 R26 R40 R48 R65 R66 R81 R95 R119 R133 R138 R147 R164 R165 R180 R194 R202 R219 R220 R235 R249 R257 R274 R275 R290 R304 R312 R329 R330 = Seeed-Resistor-2016:SMD-RES-2.2K-5%-1/8W(0805): 301010333; MPN: RC0805JR-072K2L; VALUE: 2.2K
R33 R34 R88 R89 R142 R143 R187 R188 R242 R243 R297 R298 = Seeed-Resistor-2016:SMD-RES-100R-5%-1/8W(0805): 301010319; MPN: RC0805JR-07100RL; VALUE: 100R
SJ1-SJ5 SJ101 = solder-jumper:SJ: SMD solder JUMPER
SJMP SJMP1-SJMP5 = jumper:SJ: SMD solder JUMPER
X1 X4 X7 X10 X13 X101 = con_BMW:CON_BMW: BMW CONNECTOR
X2 X5 X8 X11 X14 X103 = con_Molex_BMW:22-23-2051: .100" (2.54mm) Center Header - 5 Pin; MF: MOLEX; MPN: 22-23-2051; OC_FARNELL: 1462952; OC_NEWARK: 38C9178
X3 X6 X9 X12 X15 X102 = con_Molex_BMW:22-23-2021: .100" (2.54mm) Center Header - 2 Pin; MF: MOLEX; MPN: 22-23-2021; OC_FARNELL: 1462926; OC_NEWARK: 25C3832